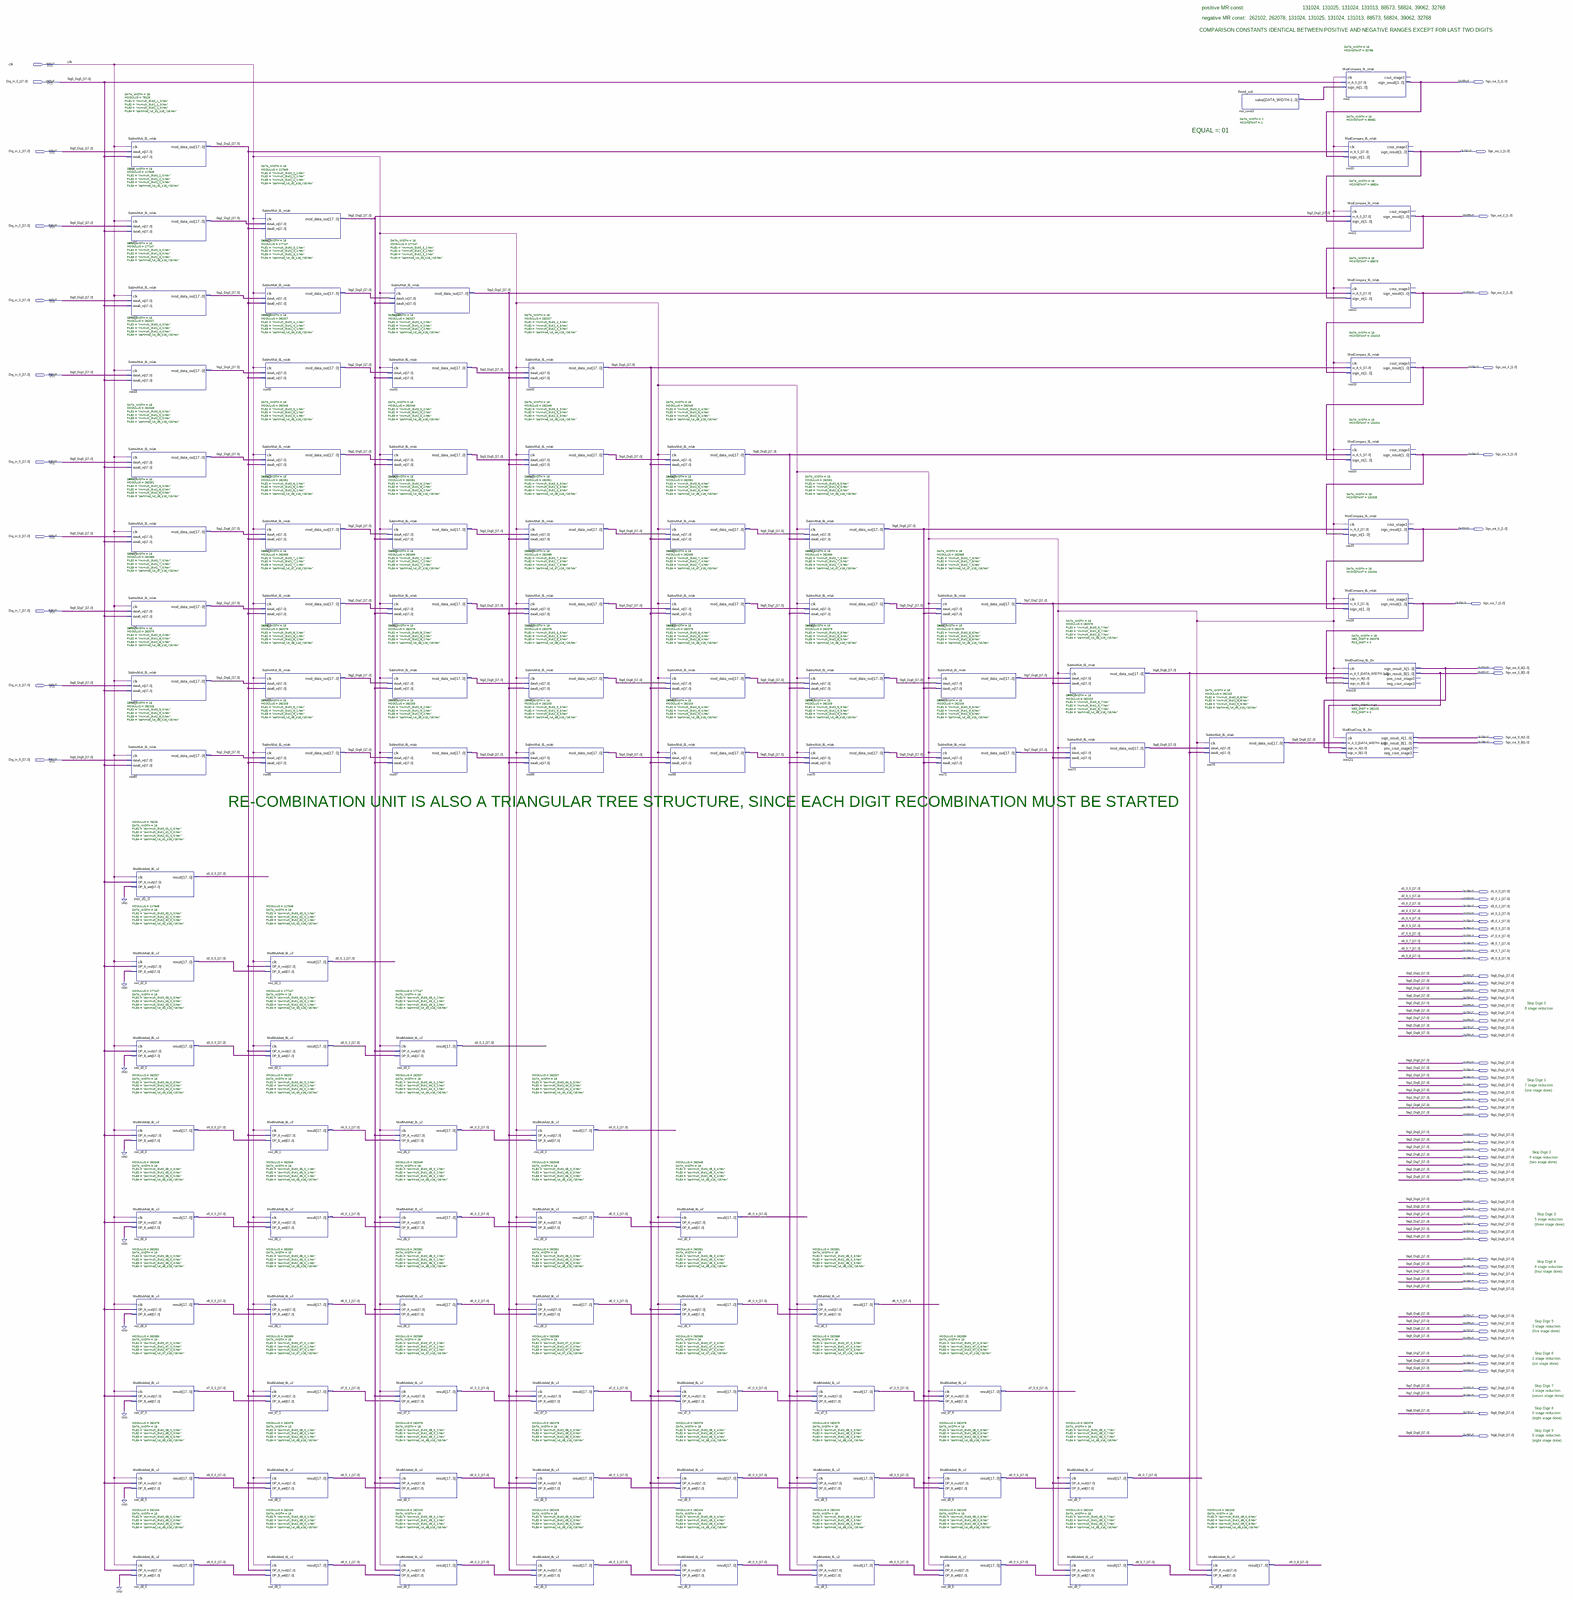
[diagram p0: schematic sheet, whole]
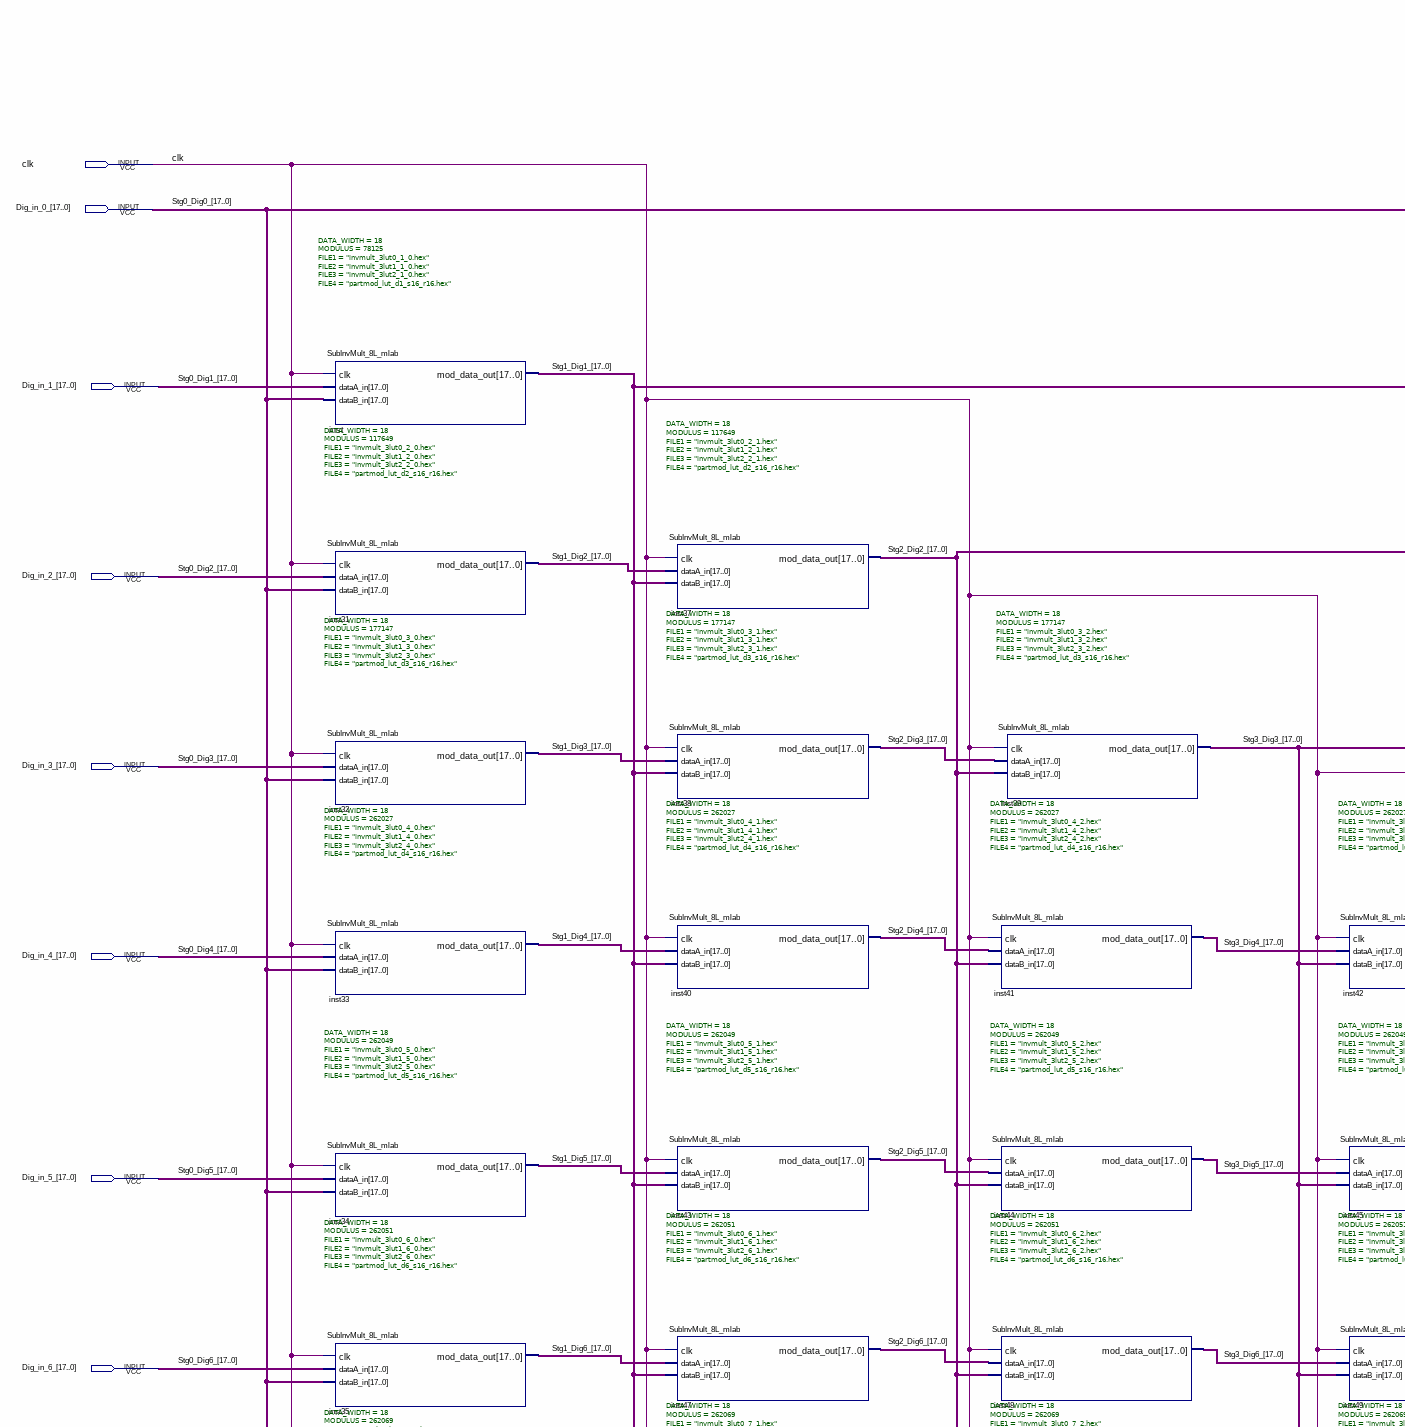
[diagram p1: schematic sheet, upper left part]
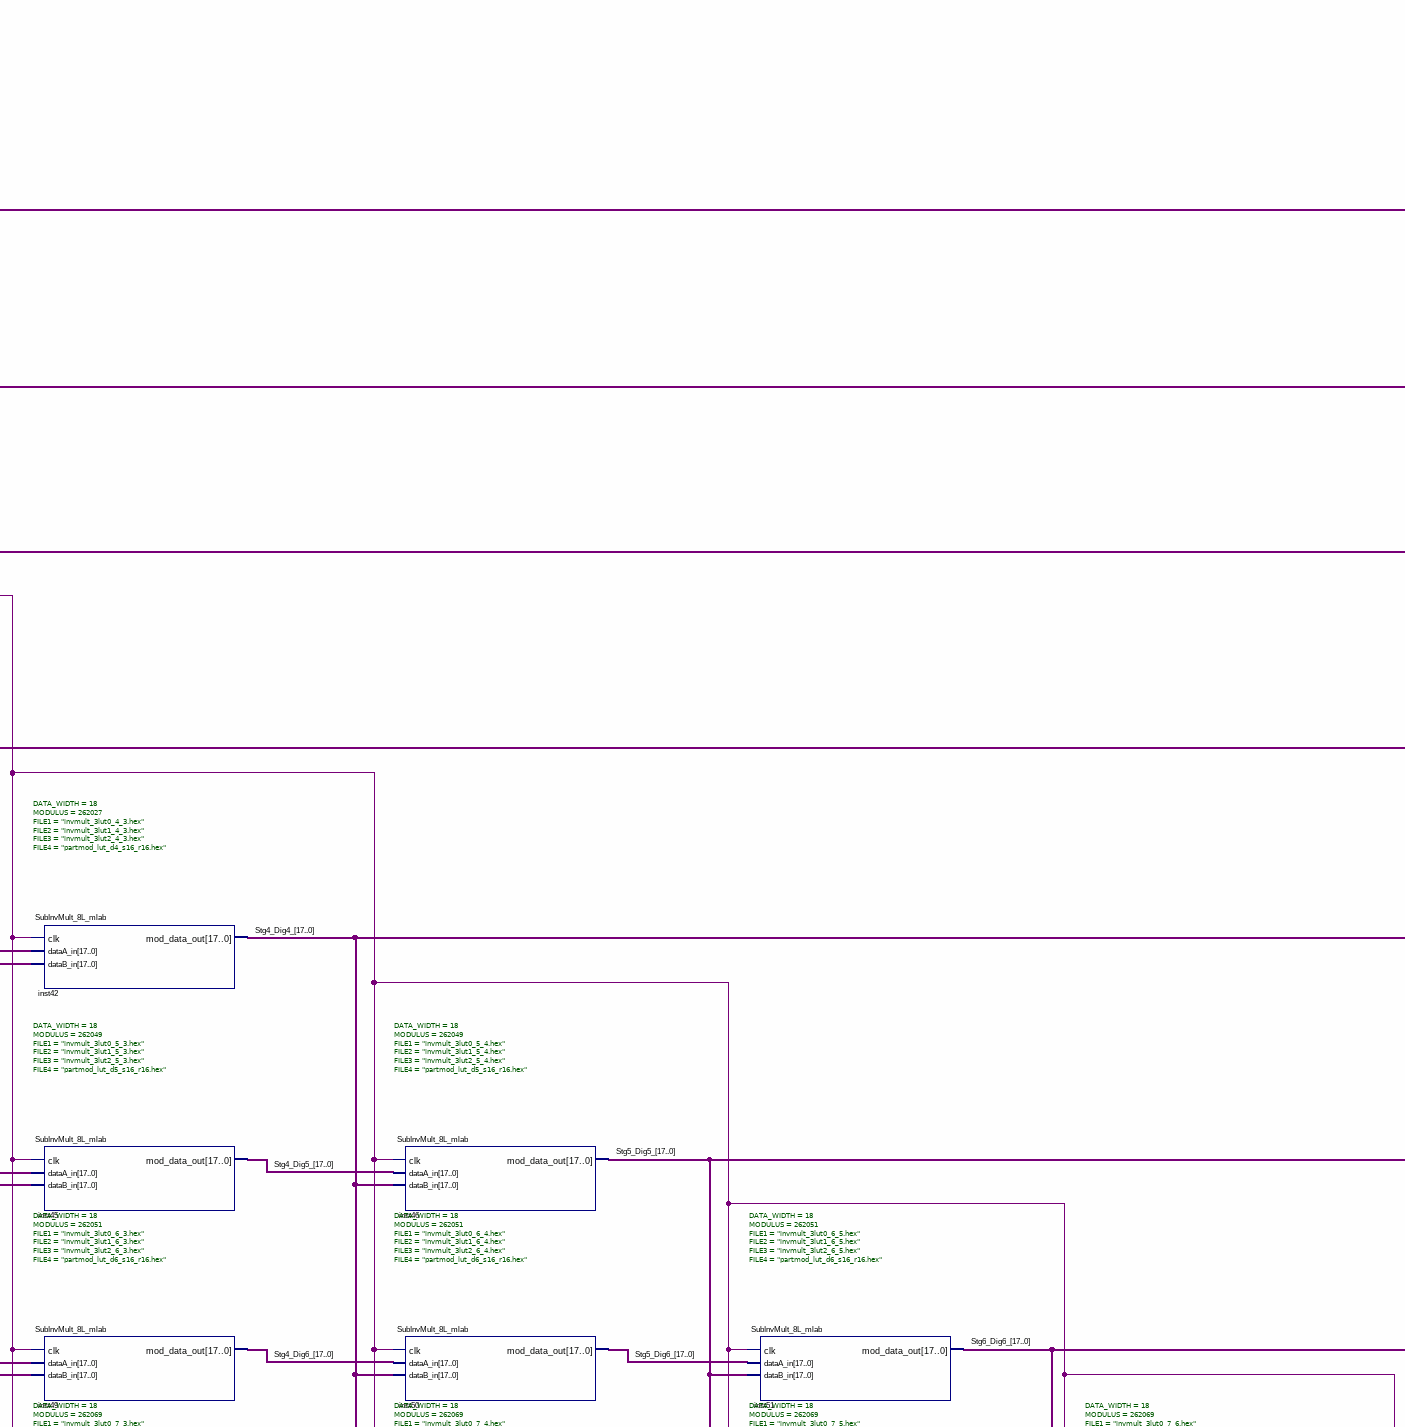
[diagram p2: schematic sheet, upper centre part]
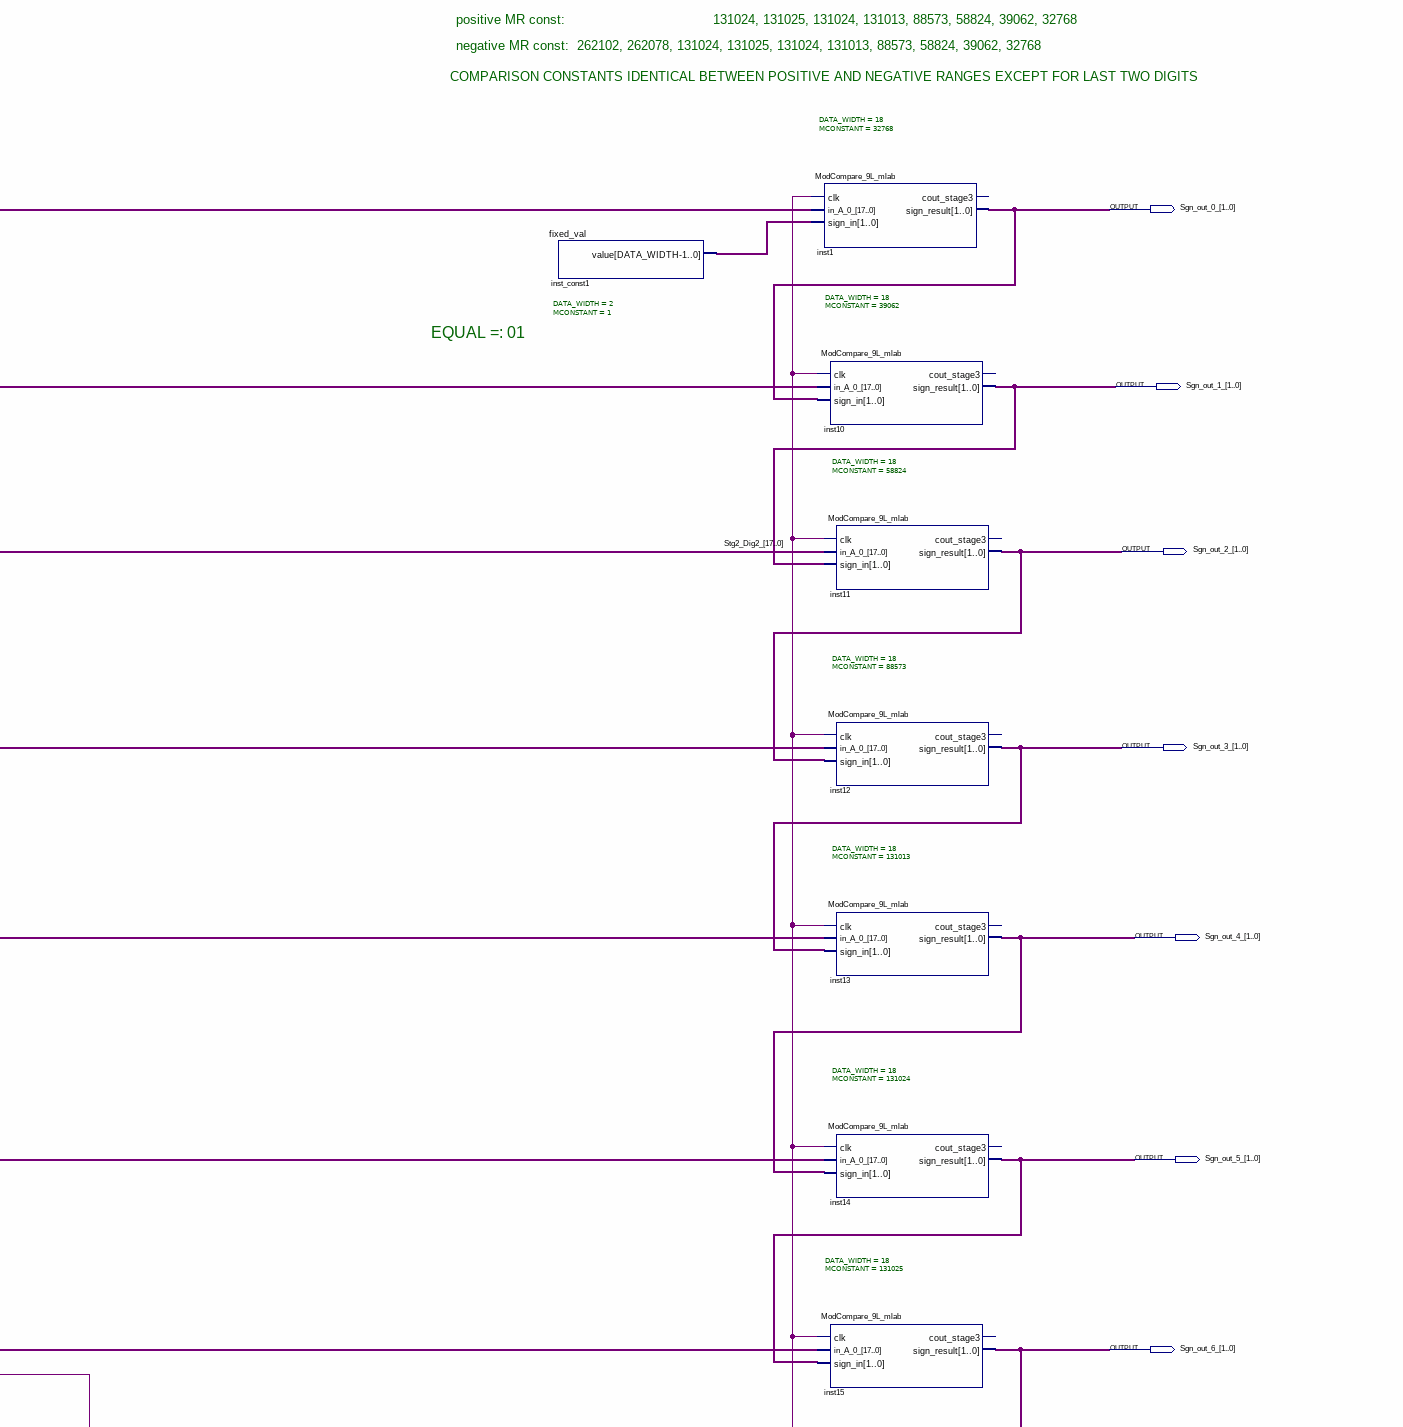
[diagram p3: schematic sheet, upper right part]
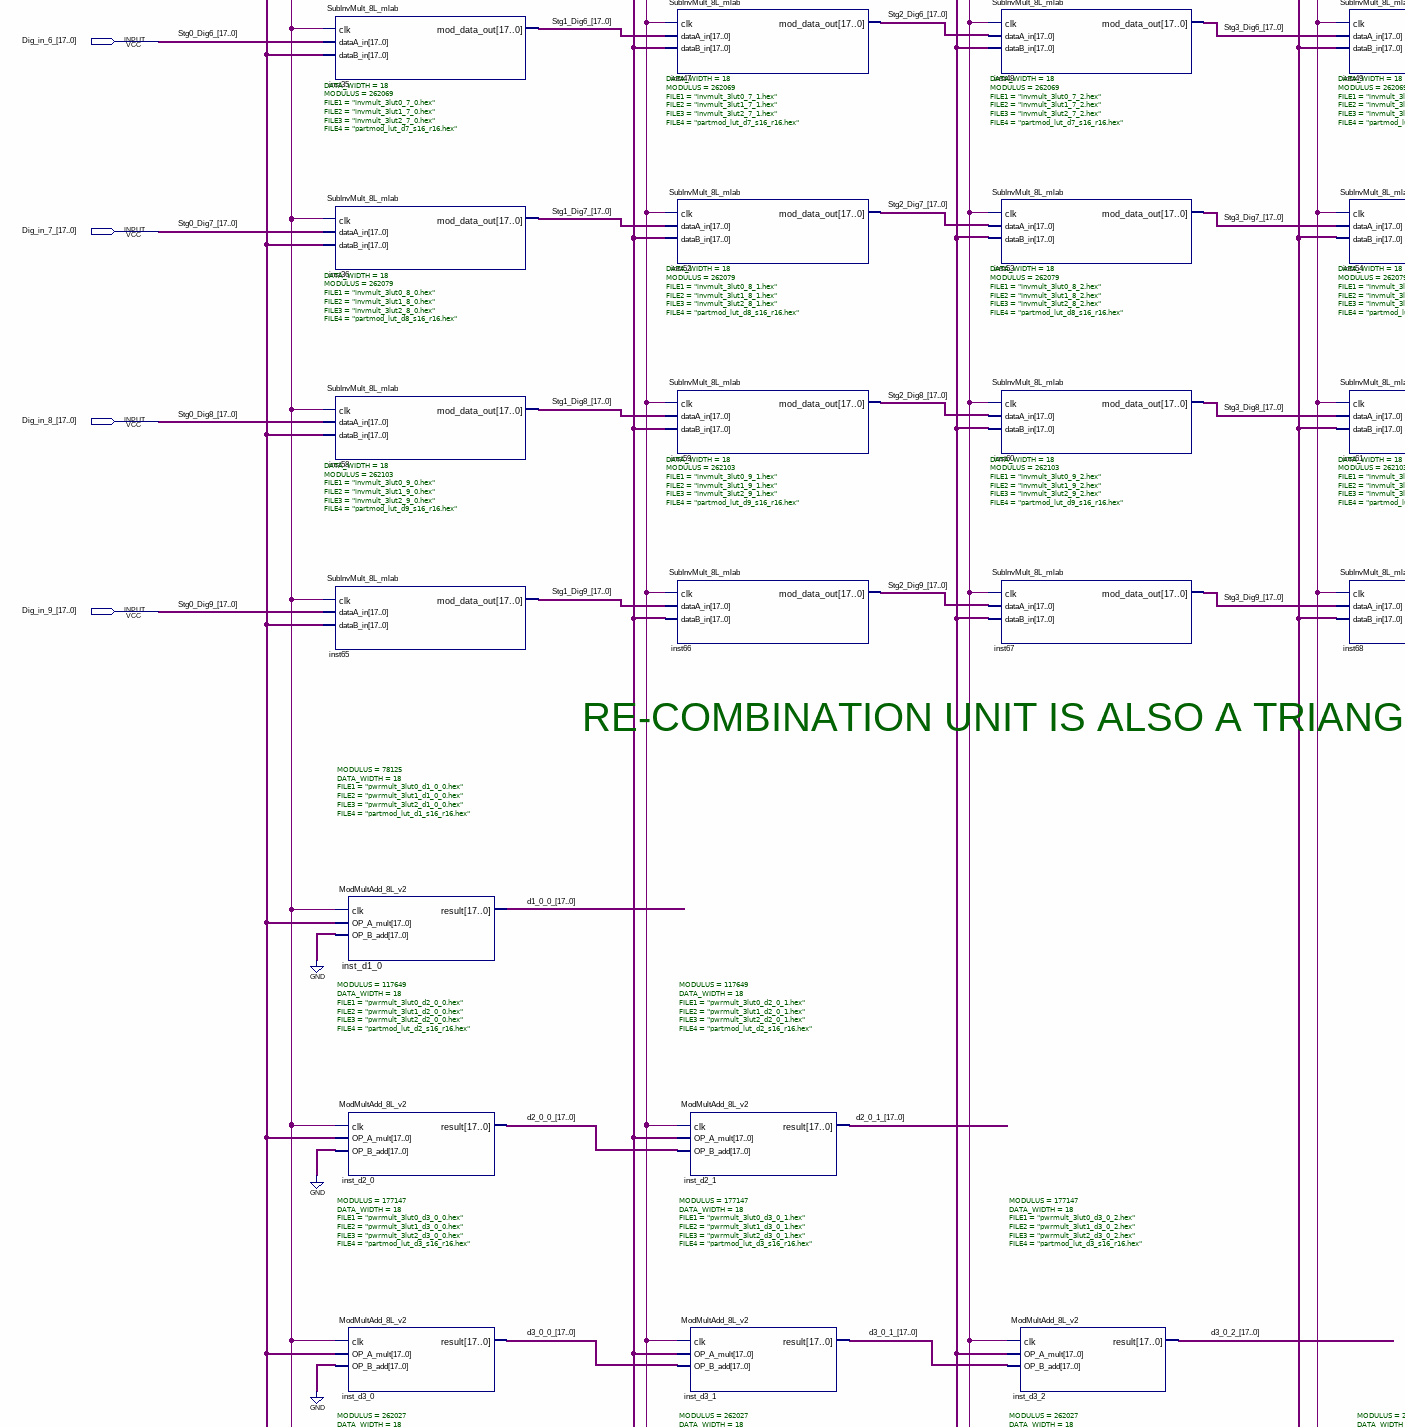
[diagram p4: schematic sheet, middle left part]
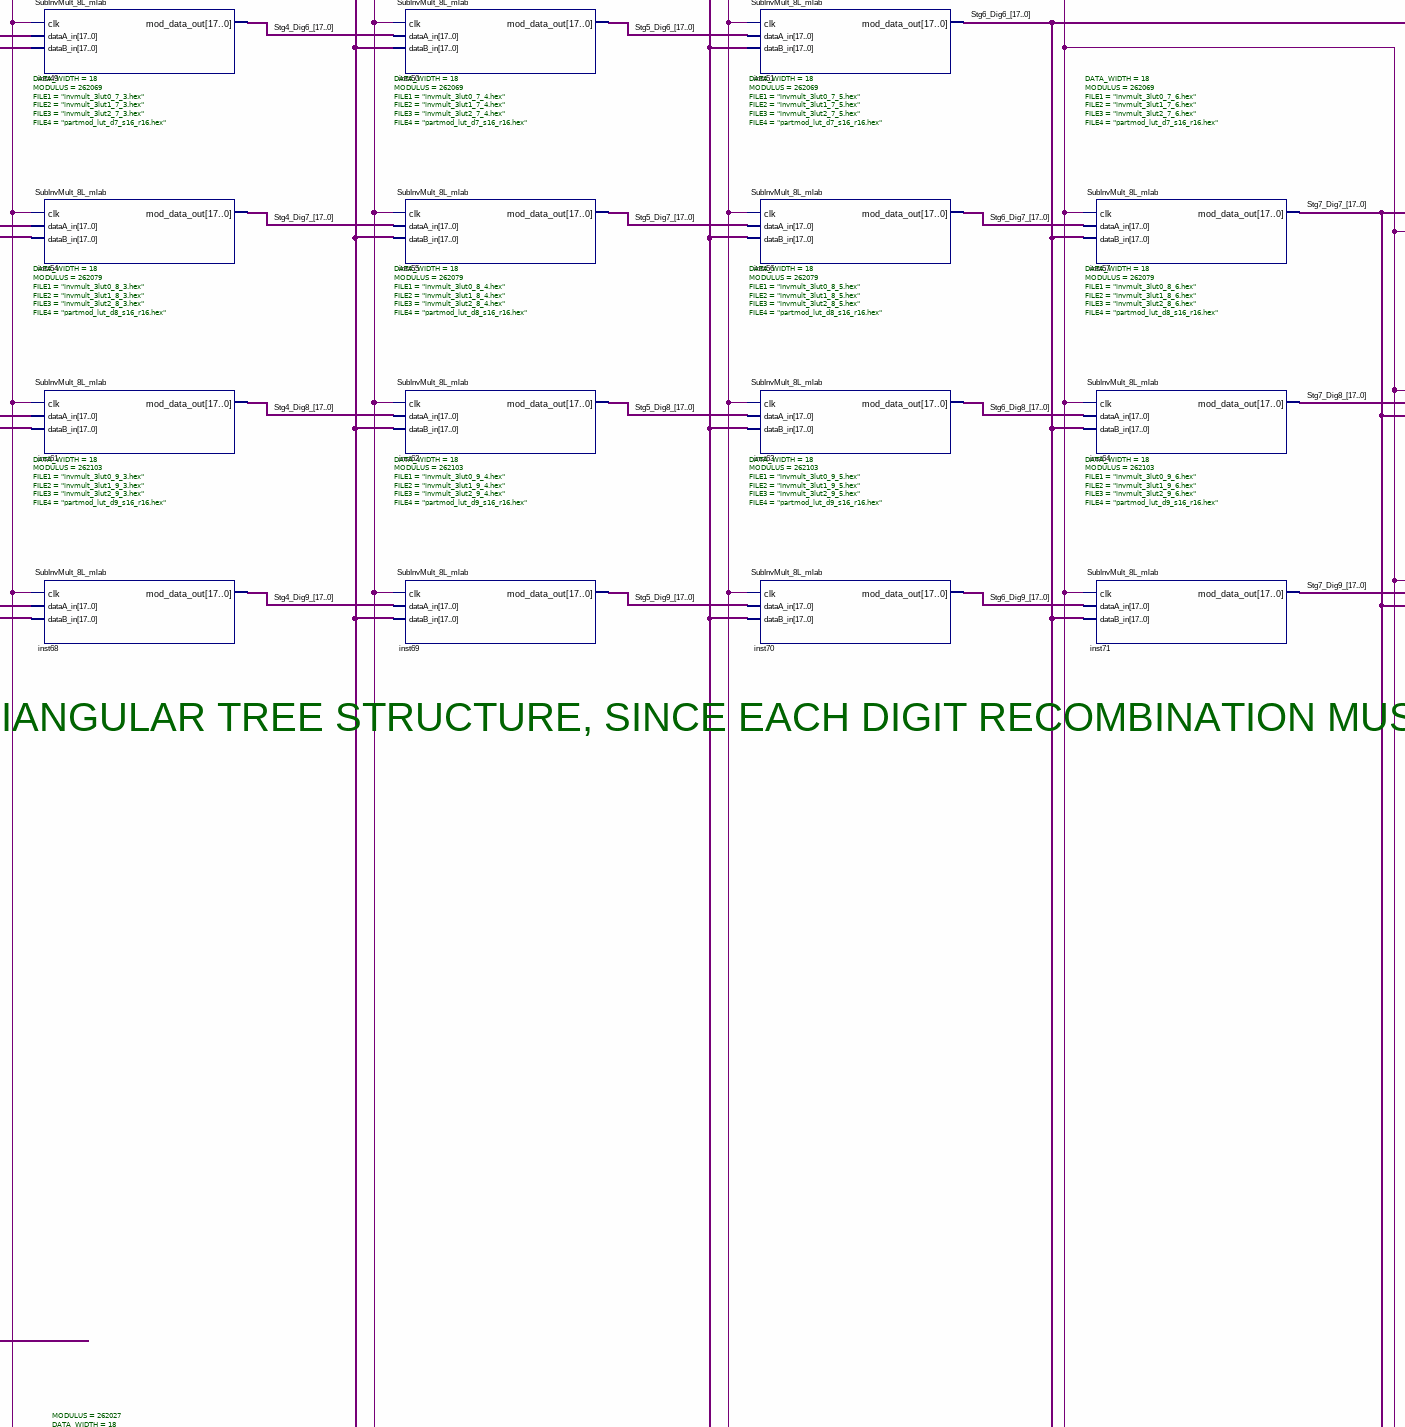
[diagram p5: schematic sheet, middle centre part]
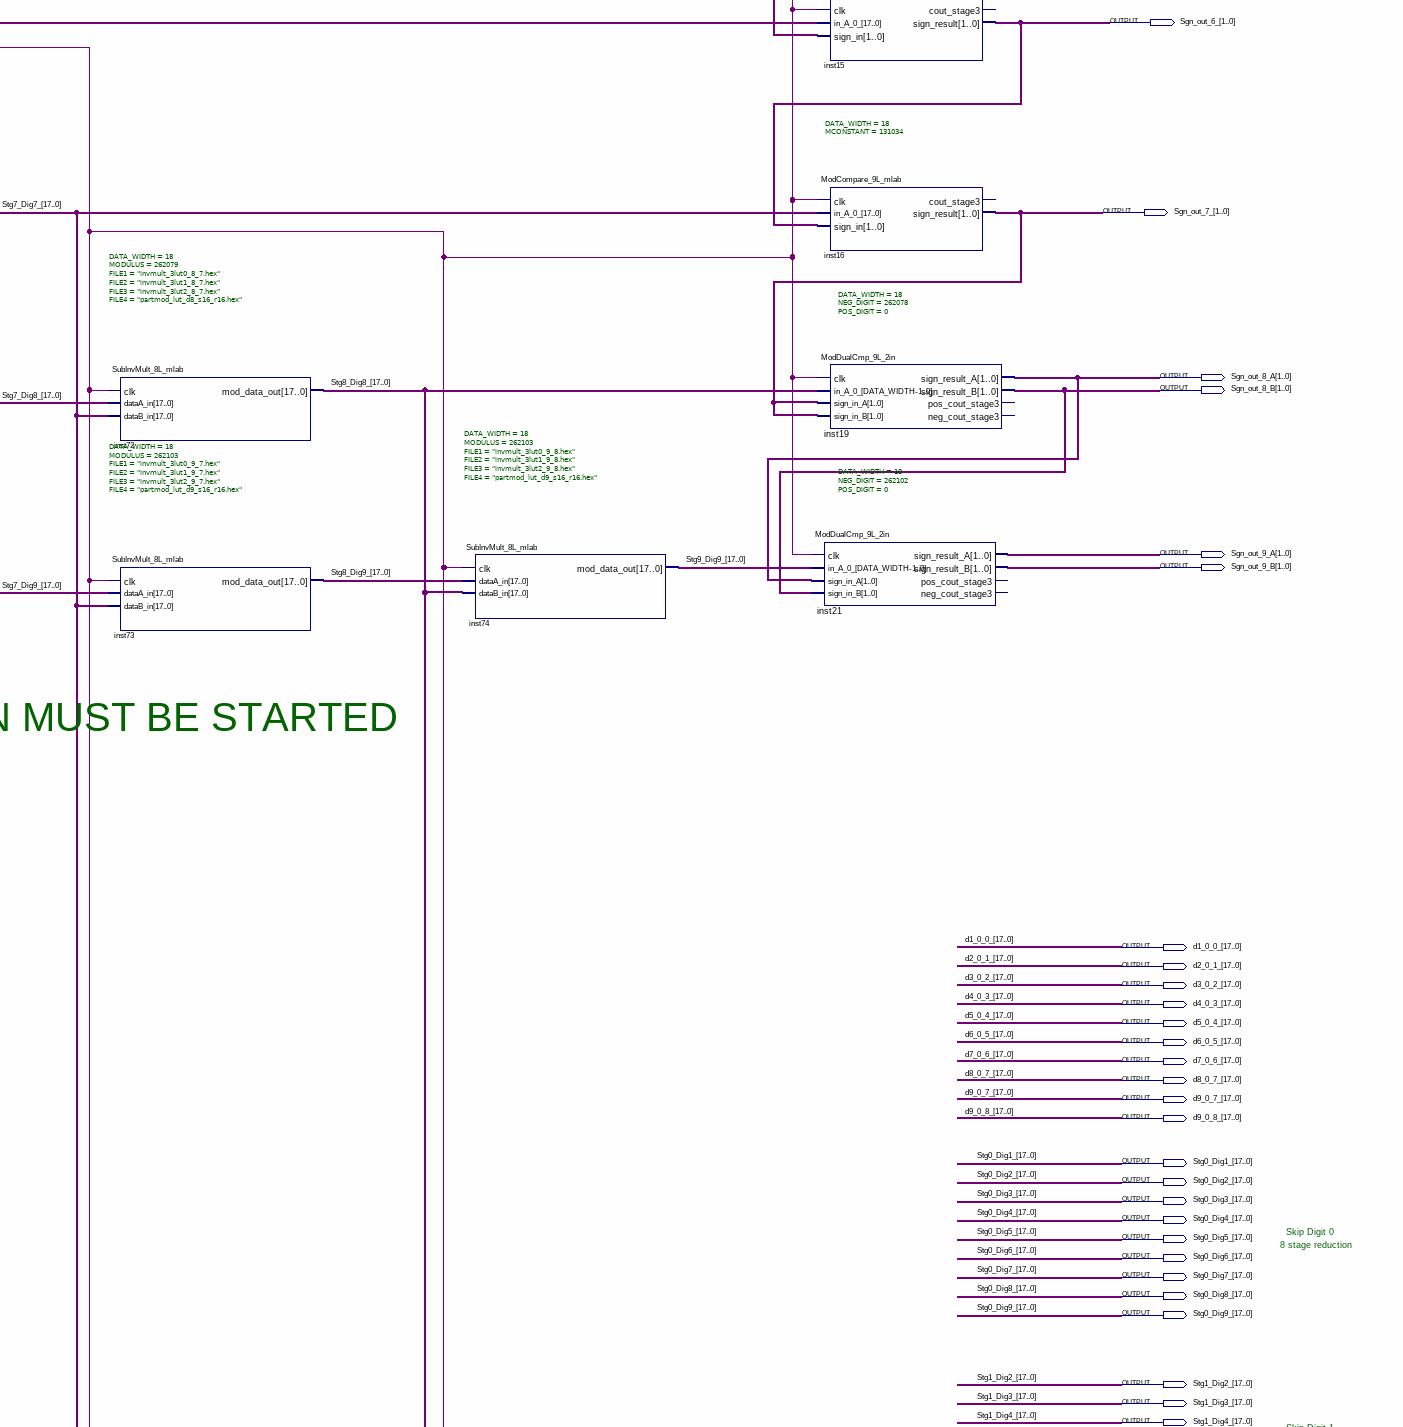
[diagram p6: schematic sheet, middle right part]
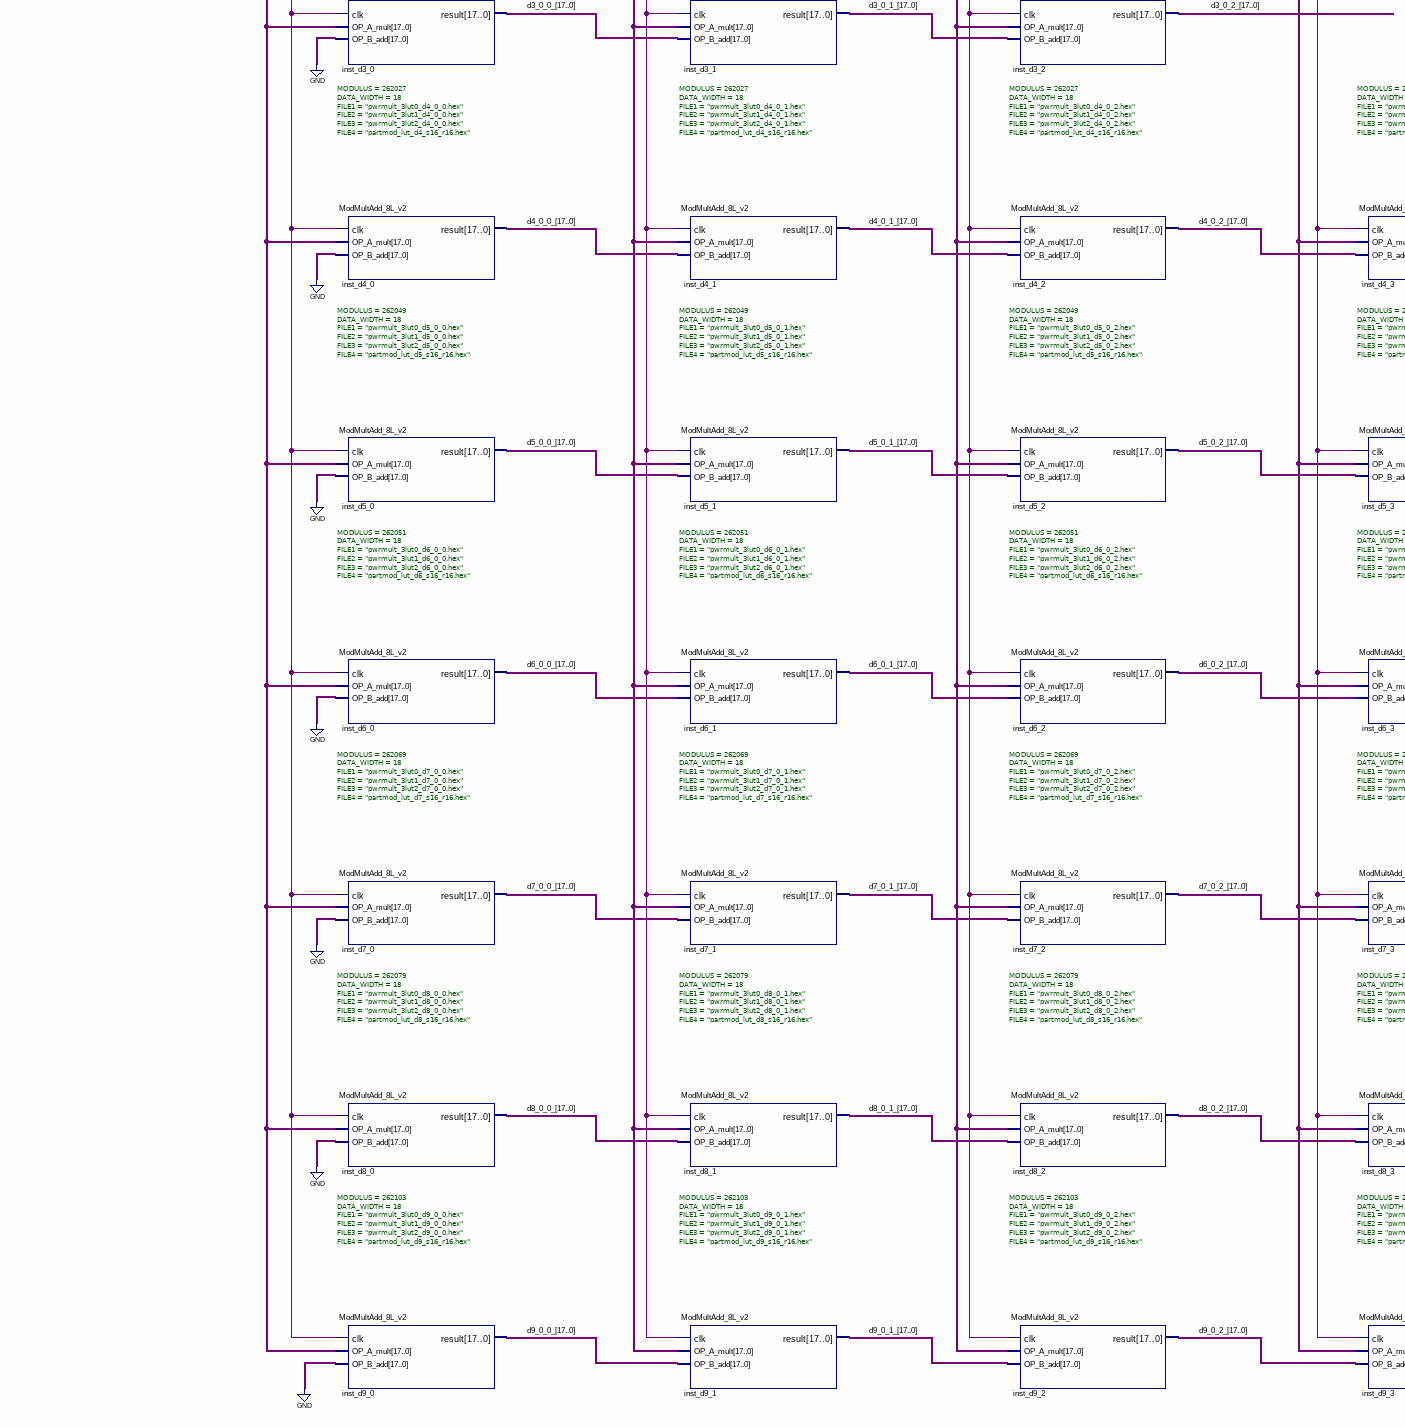
[diagram p7: schematic sheet, lower left part]
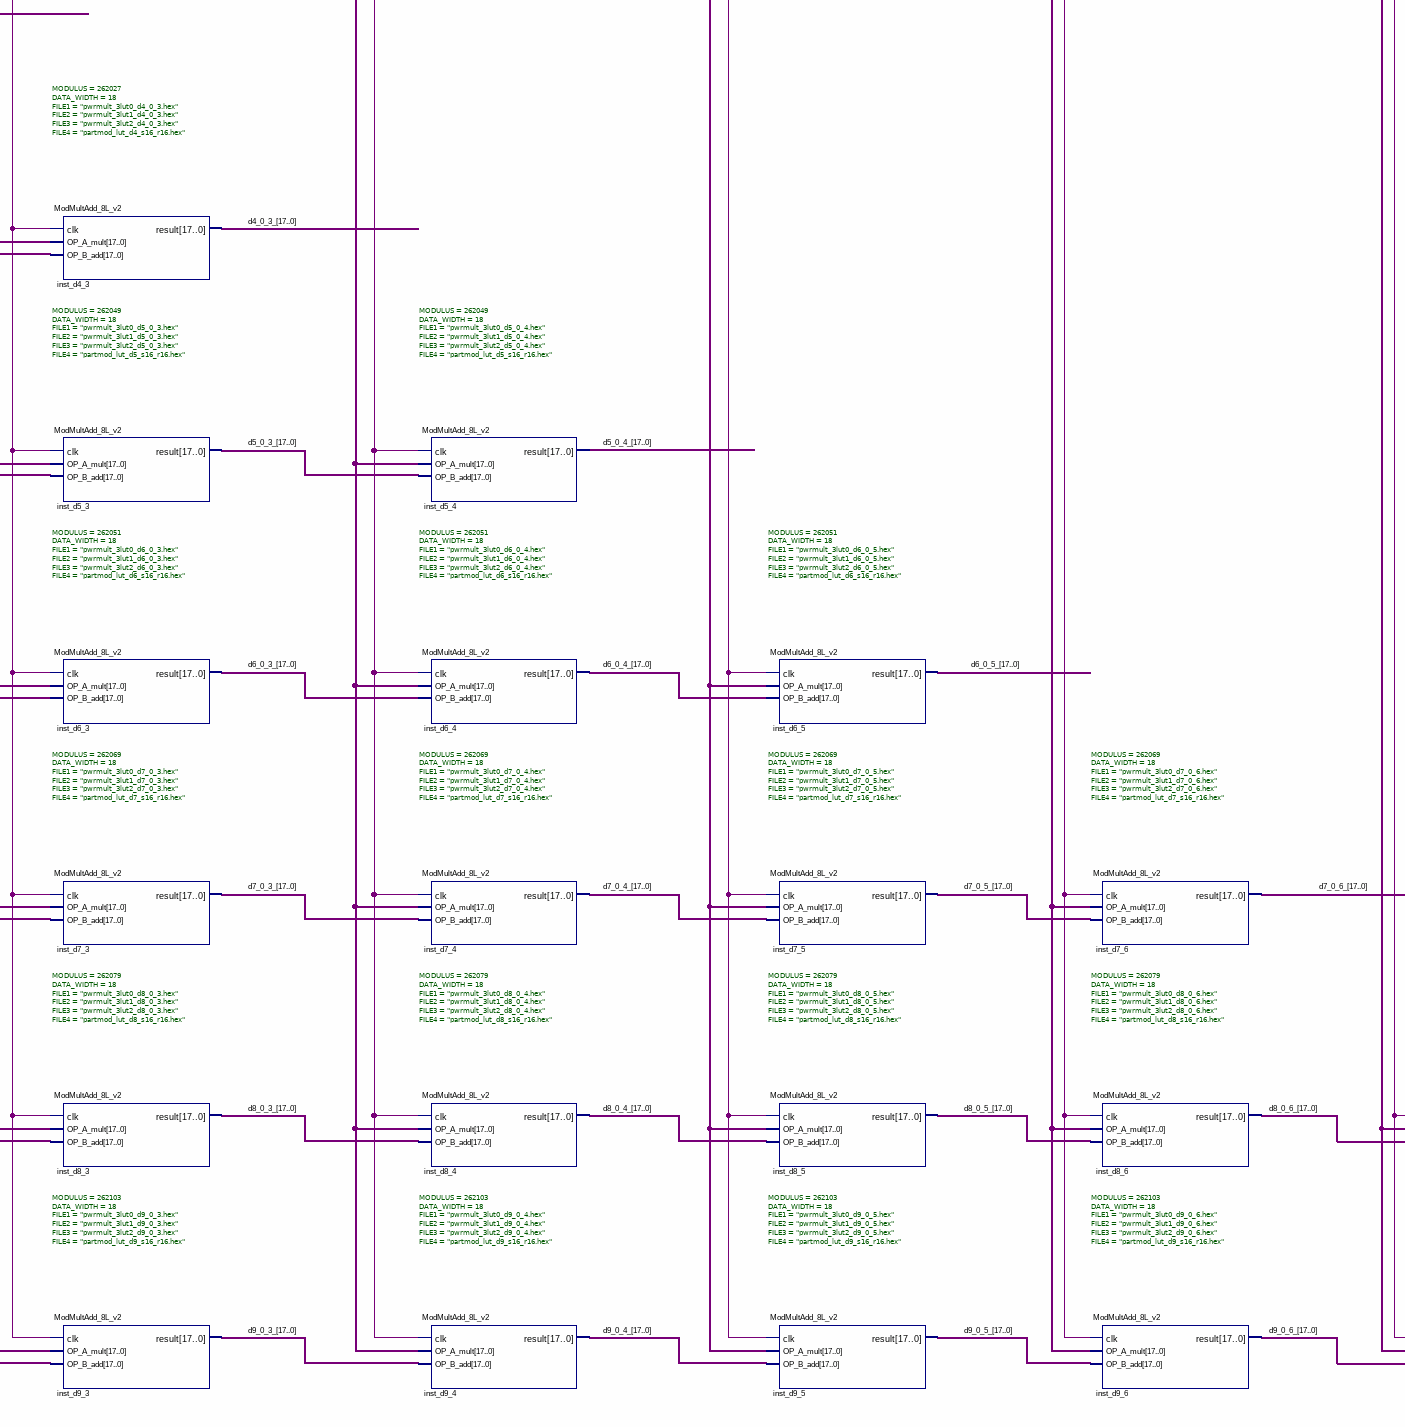
[diagram p8: schematic sheet, lower centre part]
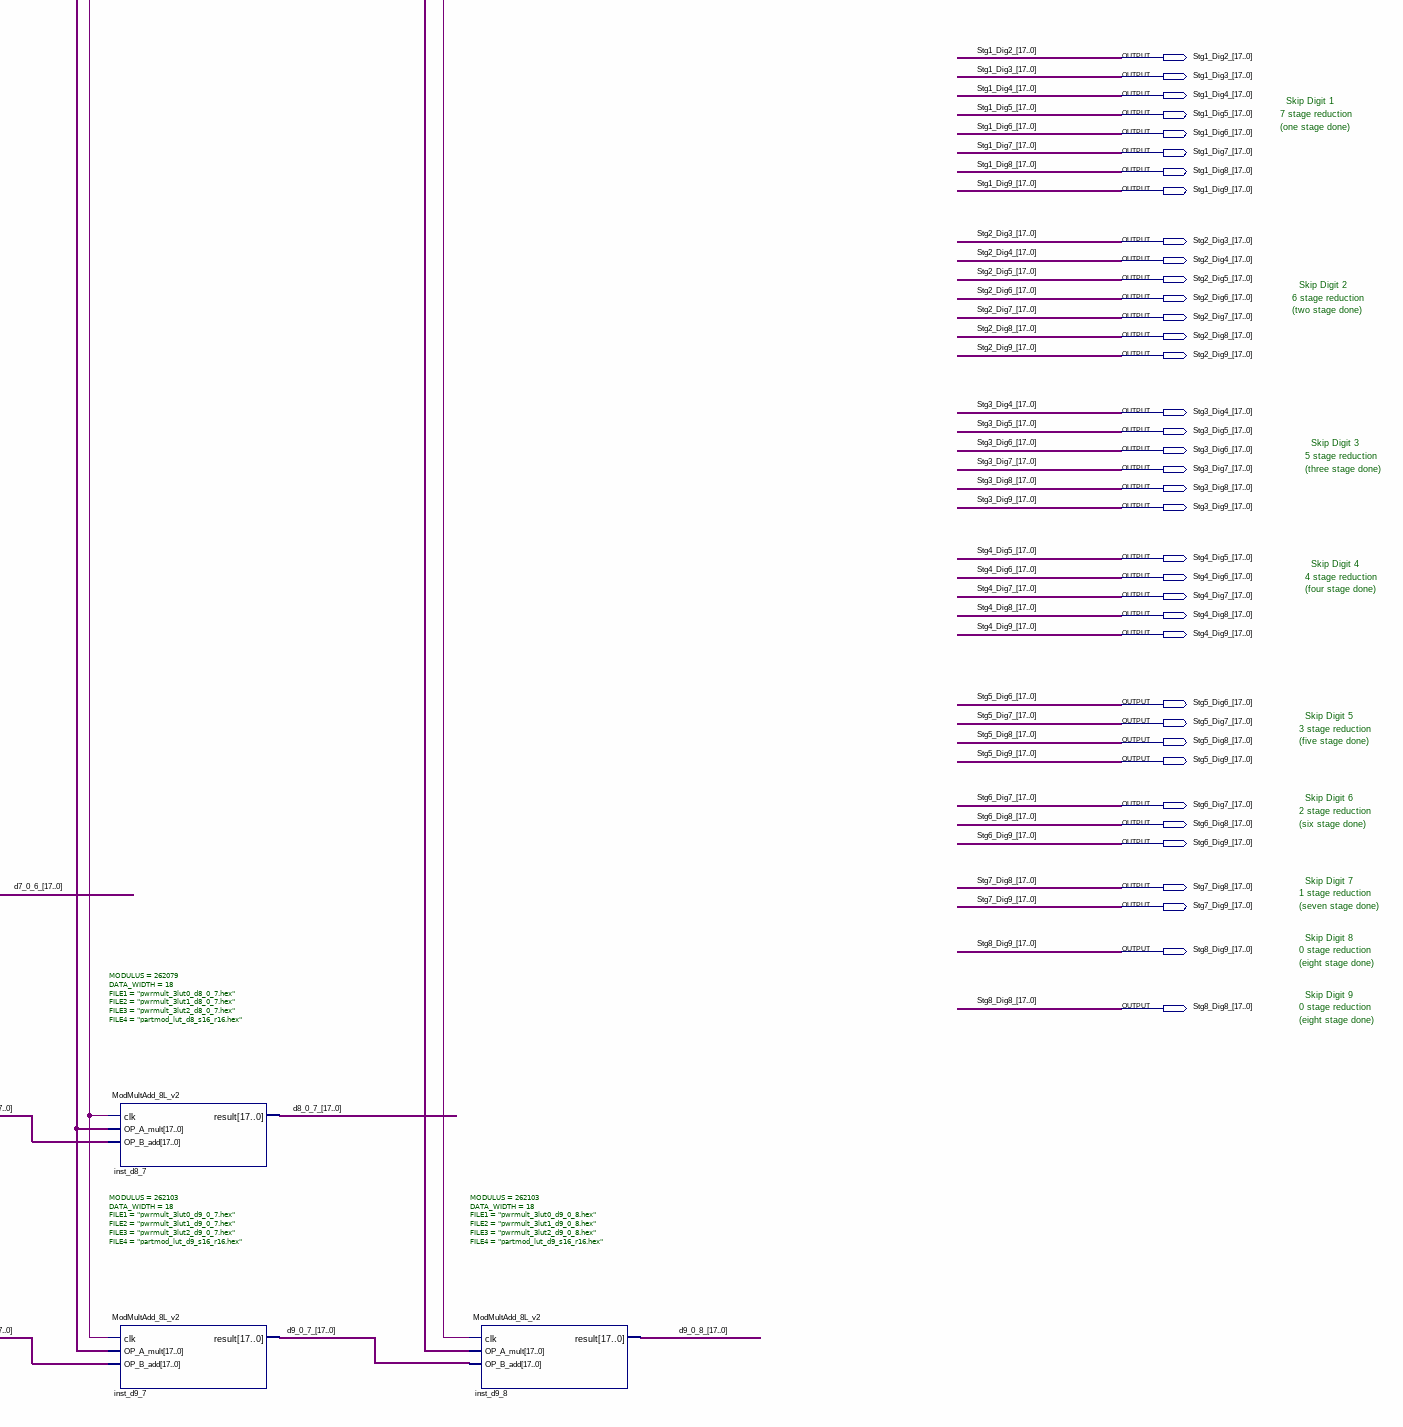
[diagram p9: schematic sheet, lower right part]
// Quartus schematic MRC_pipe_full_ec_v1.bdf as structural Verilog: 101 symbols, 79 pins
module MRC_pipe_full_ec_v1 (
  input  clk,
  input  [17:0] Dig_in_0_,
  input  [17:0] Dig_in_1_,
  input  [17:0] Dig_in_2_,
  input  [17:0] Dig_in_3_,
  input  [17:0] Dig_in_4_,
  input  [17:0] Dig_in_5_,
  input  [17:0] Dig_in_6_,
  input  [17:0] Dig_in_7_,
  input  [17:0] Dig_in_8_,
  input  [17:0] Dig_in_9_,
  output [1:0] Sgn_out_0_,
  output [1:0] Sgn_out_1_,
  output [1:0] Sgn_out_2_,
  output [1:0] Sgn_out_3_,
  output [1:0] Sgn_out_4_,
  output [1:0] Sgn_out_5_,
  output [1:0] Sgn_out_6_,
  output [1:0] Sgn_out_7_,
  output [1:0] Sgn_out_8_A,
  output [1:0] Sgn_out_8_B,
  output [1:0] Sgn_out_9_A,
  output [1:0] Sgn_out_9_B,
  output [17:0] d1_0_0_,
  output [17:0] d2_0_1_,
  output [17:0] d3_0_2_,
  output [17:0] d4_0_3_,
  output [17:0] d5_0_4_,
  output [17:0] d6_0_5_,
  output [17:0] d7_0_6_,
  output [17:0] d8_0_7_,
  output [17:0] d9_0_7_,
  output [17:0] d9_0_8_,
  output [17:0] Stg0_Dig1_,
  output [17:0] Stg0_Dig2_,
  output [17:0] Stg0_Dig3_,
  output [17:0] Stg0_Dig4_,
  output [17:0] Stg0_Dig5_,
  output [17:0] Stg0_Dig6_,
  output [17:0] Stg0_Dig7_,
  output [17:0] Stg0_Dig8_,
  output [17:0] Stg0_Dig9_,
  output [17:0] Stg1_Dig2_,
  output [17:0] Stg1_Dig3_,
  output [17:0] Stg1_Dig4_,
  output [17:0] Stg1_Dig5_,
  output [17:0] Stg1_Dig6_,
  output [17:0] Stg1_Dig7_,
  output [17:0] Stg1_Dig8_,
  output [17:0] Stg1_Dig9_,
  output [17:0] Stg2_Dig3_,
  output [17:0] Stg2_Dig4_,
  output [17:0] Stg2_Dig5_,
  output [17:0] Stg2_Dig6_,
  output [17:0] Stg2_Dig7_,
  output [17:0] Stg2_Dig8_,
  output [17:0] Stg2_Dig9_,
  output [17:0] Stg3_Dig4_,
  output [17:0] Stg3_Dig5_,
  output [17:0] Stg3_Dig6_,
  output [17:0] Stg3_Dig7_,
  output [17:0] Stg3_Dig8_,
  output [17:0] Stg3_Dig9_,
  output [17:0] Stg4_Dig5_,
  output [17:0] Stg4_Dig6_,
  output [17:0] Stg4_Dig7_,
  output [17:0] Stg4_Dig8_,
  output [17:0] Stg4_Dig9_,
  output [17:0] Stg5_Dig6_,
  output [17:0] Stg5_Dig7_,
  output [17:0] Stg5_Dig8_,
  output [17:0] Stg5_Dig9_,
  output [17:0] Stg6_Dig7_,
  output [17:0] Stg6_Dig8_,
  output [17:0] Stg6_Dig9_,
  output [17:0] Stg7_Dig8_,
  output [17:0] Stg7_Dig9_,
  output [17:0] Stg8_Dig9_,
  output [17:0] Stg8_Dig8_
);

  wire [1:0] inst_const1_value;
  wire [17:0] d2_0_0_, d3_0_0_, d3_0_1_, d4_0_0_, d4_0_1_, d4_0_2_, d5_0_0_, d5_0_1_, d5_0_2_, d5_0_3_,
       d6_0_0_, d6_0_1_, d6_0_2_, d6_0_3_, d6_0_4_, d7_0_0_, d7_0_1_, d7_0_2_, d7_0_3_, d7_0_4_, d7_0_5_,
       d8_0_0_, d8_0_1_, d8_0_2_, d8_0_3_, d8_0_4_, d8_0_5_, d8_0_6_, d9_0_0_, d9_0_1_, d9_0_2_, d9_0_3_,
       d9_0_4_, d9_0_5_, d9_0_6_, Stg1_Dig1_, Stg2_Dig2_, Stg3_Dig3_, Stg4_Dig4_, Stg5_Dig5_, Stg6_Dig6_,
       Stg7_Dig7_, Stg9_Dig9_;

  SubInvMult_8L_mlab #(.DATA_WIDTH(18), .MODULUS(78125), .FILE1("invmult_3lut0_1_0.hex"), .FILE2("invmult_3lut1_1_0.hex"), .FILE3("invmult_3lut2_1_0.hex"), .FILE4("partmod_lut_d1_s16_r16.hex")) inst (
    .clk(clk), .dataA_in(Dig_in_1_), .dataB_in(Dig_in_0_), .mod_data_out(Stg1_Dig1_));
  SubInvMult_8L_mlab #(.DATA_WIDTH(18), .MODULUS(117649), .FILE1("invmult_3lut0_2_0.hex"), .FILE2("invmult_3lut1_2_0.hex"), .FILE3("invmult_3lut2_2_0.hex"), .FILE4("partmod_lut_d2_s16_r16.hex")) inst31 (
    .clk(clk), .dataA_in(Dig_in_2_), .dataB_in(Dig_in_0_), .mod_data_out(Stg1_Dig2_));
  SubInvMult_8L_mlab #(.DATA_WIDTH(18), .MODULUS(177147), .FILE1("invmult_3lut0_3_0.hex"), .FILE2("invmult_3lut1_3_0.hex"), .FILE3("invmult_3lut2_3_0.hex"), .FILE4("partmod_lut_d3_s16_r16.hex")) inst32 (
    .clk(clk), .dataA_in(Dig_in_3_), .dataB_in(Dig_in_0_), .mod_data_out(Stg1_Dig3_));
  SubInvMult_8L_mlab #(.DATA_WIDTH(18), .MODULUS(262027), .FILE1("invmult_3lut0_4_0.hex"), .FILE2("invmult_3lut1_4_0.hex"), .FILE3("invmult_3lut2_4_0.hex"), .FILE4("partmod_lut_d4_s16_r16.hex")) inst33 (
    .clk(clk), .dataA_in(Dig_in_4_), .dataB_in(Dig_in_0_), .mod_data_out(Stg1_Dig4_));
  SubInvMult_8L_mlab #(.DATA_WIDTH(18), .MODULUS(262049), .FILE1("invmult_3lut0_5_0.hex"), .FILE2("invmult_3lut1_5_0.hex"), .FILE3("invmult_3lut2_5_0.hex"), .FILE4("partmod_lut_d5_s16_r16.hex")) inst34 (
    .clk(clk), .dataA_in(Dig_in_5_), .dataB_in(Dig_in_0_), .mod_data_out(Stg1_Dig5_));
  SubInvMult_8L_mlab #(.DATA_WIDTH(18), .MODULUS(262051), .FILE1("invmult_3lut0_6_0.hex"), .FILE2("invmult_3lut1_6_0.hex"), .FILE3("invmult_3lut2_6_0.hex"), .FILE4("partmod_lut_d6_s16_r16.hex")) inst35 (
    .clk(clk), .dataA_in(Dig_in_6_), .dataB_in(Dig_in_0_), .mod_data_out(Stg1_Dig6_));
  SubInvMult_8L_mlab #(.DATA_WIDTH(18), .MODULUS(262069), .FILE1("invmult_3lut0_7_0.hex"), .FILE2("invmult_3lut1_7_0.hex"), .FILE3("invmult_3lut2_7_0.hex"), .FILE4("partmod_lut_d7_s16_r16.hex")) inst36 (
    .clk(clk), .dataA_in(Dig_in_7_), .dataB_in(Dig_in_0_), .mod_data_out(Stg1_Dig7_));
  SubInvMult_8L_mlab #(.DATA_WIDTH(18), .MODULUS(262079), .FILE1("invmult_3lut0_8_0.hex"), .FILE2("invmult_3lut1_8_0.hex"), .FILE3("invmult_3lut2_8_0.hex"), .FILE4("partmod_lut_d8_s16_r16.hex")) inst58 (
    .clk(clk), .dataA_in(Dig_in_8_), .dataB_in(Dig_in_0_), .mod_data_out(Stg1_Dig8_));
  SubInvMult_8L_mlab #(.DATA_WIDTH(18), .MODULUS(262103), .FILE1("invmult_3lut0_9_0.hex"), .FILE2("invmult_3lut1_9_0.hex"), .FILE3("invmult_3lut2_9_0.hex"), .FILE4("partmod_lut_d9_s16_r16.hex")) inst65 (
    .clk(clk), .dataA_in(Dig_in_9_), .dataB_in(Dig_in_0_), .mod_data_out(Stg1_Dig9_));
  ModMultAdd_8L_v2 #(.MODULUS(78125), .DATA_WIDTH(18), .FILE1("pwrmult_3lut0_d1_0_0.hex"), .FILE2("pwrmult_3lut1_d1_0_0.hex"), .FILE3("pwrmult_3lut2_d1_0_0.hex"), .FILE4("partmod_lut_d1_s16_r16.hex")) inst_d1_0 (
    .clk(clk), .OP_A_mult(Dig_in_0_), .OP_B_add({18{1'b0}}), .result(d1_0_0_));
  ModMultAdd_8L_v2 #(.MODULUS(117649), .DATA_WIDTH(18), .FILE1("pwrmult_3lut0_d2_0_0.hex"), .FILE2("pwrmult_3lut1_d2_0_0.hex"), .FILE3("pwrmult_3lut2_d2_0_0.hex"), .FILE4("partmod_lut_d2_s16_r16.hex")) inst_d2_0 (
    .clk(clk), .OP_A_mult(Dig_in_0_), .OP_B_add({18{1'b0}}), .result(d2_0_0_));
  ModMultAdd_8L_v2 #(.MODULUS(177147), .DATA_WIDTH(18), .FILE1("pwrmult_3lut0_d3_0_0.hex"), .FILE2("pwrmult_3lut1_d3_0_0.hex"), .FILE3("pwrmult_3lut2_d3_0_0.hex"), .FILE4("partmod_lut_d3_s16_r16.hex")) inst_d3_0 (
    .clk(clk), .OP_A_mult(Dig_in_0_), .OP_B_add({18{1'b0}}), .result(d3_0_0_));
  ModMultAdd_8L_v2 #(.MODULUS(262027), .DATA_WIDTH(18), .FILE1("pwrmult_3lut0_d4_0_0.hex"), .FILE2("pwrmult_3lut1_d4_0_0.hex"), .FILE3("pwrmult_3lut2_d4_0_0.hex"), .FILE4("partmod_lut_d4_s16_r16.hex")) inst_d4_0 (
    .clk(clk), .OP_A_mult(Dig_in_0_), .OP_B_add({18{1'b0}}), .result(d4_0_0_));
  ModMultAdd_8L_v2 #(.MODULUS(262049), .DATA_WIDTH(18), .FILE1("pwrmult_3lut0_d5_0_0.hex"), .FILE2("pwrmult_3lut1_d5_0_0.hex"), .FILE3("pwrmult_3lut2_d5_0_0.hex"), .FILE4("partmod_lut_d5_s16_r16.hex")) inst_d5_0 (
    .clk(clk), .OP_A_mult(Dig_in_0_), .OP_B_add({18{1'b0}}), .result(d5_0_0_));
  ModMultAdd_8L_v2 #(.MODULUS(262051), .DATA_WIDTH(18), .FILE1("pwrmult_3lut0_d6_0_0.hex"), .FILE2("pwrmult_3lut1_d6_0_0.hex"), .FILE3("pwrmult_3lut2_d6_0_0.hex"), .FILE4("partmod_lut_d6_s16_r16.hex")) inst_d6_0 (
    .clk(clk), .OP_A_mult(Dig_in_0_), .OP_B_add({18{1'b0}}), .result(d6_0_0_));
  ModMultAdd_8L_v2 #(.MODULUS(262069), .DATA_WIDTH(18), .FILE1("pwrmult_3lut0_d7_0_0.hex"), .FILE2("pwrmult_3lut1_d7_0_0.hex"), .FILE3("pwrmult_3lut2_d7_0_0.hex"), .FILE4("partmod_lut_d7_s16_r16.hex")) inst_d7_0 (
    .clk(clk), .OP_A_mult(Dig_in_0_), .OP_B_add({18{1'b0}}), .result(d7_0_0_));
  ModMultAdd_8L_v2 #(.MODULUS(262079), .DATA_WIDTH(18), .FILE1("pwrmult_3lut0_d8_0_0.hex"), .FILE2("pwrmult_3lut1_d8_0_0.hex"), .FILE3("pwrmult_3lut2_d8_0_0.hex"), .FILE4("partmod_lut_d8_s16_r16.hex")) inst_d8_0 (
    .clk(clk), .OP_A_mult(Dig_in_0_), .OP_B_add({18{1'b0}}), .result(d8_0_0_));
  ModMultAdd_8L_v2 #(.MODULUS(262103), .DATA_WIDTH(18), .FILE1("pwrmult_3lut0_d9_0_0.hex"), .FILE2("pwrmult_3lut1_d9_0_0.hex"), .FILE3("pwrmult_3lut2_d9_0_0.hex"), .FILE4("partmod_lut_d9_s16_r16.hex")) inst_d9_0 (
    .clk(clk), .OP_A_mult(Dig_in_0_), .OP_B_add({18{1'b0}}), .result(d9_0_0_));
  SubInvMult_8L_mlab #(.DATA_WIDTH(18), .MODULUS(117649), .FILE1("invmult_3lut0_2_1.hex"), .FILE2("invmult_3lut1_2_1.hex"), .FILE3("invmult_3lut2_2_1.hex"), .FILE4("partmod_lut_d2_s16_r16.hex")) inst37 (
    .clk(clk), .dataA_in(Stg1_Dig2_), .dataB_in(Stg1_Dig1_), .mod_data_out(Stg2_Dig2_));
  SubInvMult_8L_mlab #(.DATA_WIDTH(18), .MODULUS(177147), .FILE1("invmult_3lut0_3_1.hex"), .FILE2("invmult_3lut1_3_1.hex"), .FILE3("invmult_3lut2_3_1.hex"), .FILE4("partmod_lut_d3_s16_r16.hex")) inst38 (
    .clk(clk), .dataA_in(Stg1_Dig3_), .dataB_in(Stg1_Dig1_), .mod_data_out(Stg2_Dig3_));
  SubInvMult_8L_mlab #(.DATA_WIDTH(18), .MODULUS(262027), .FILE1("invmult_3lut0_4_1.hex"), .FILE2("invmult_3lut1_4_1.hex"), .FILE3("invmult_3lut2_4_1.hex"), .FILE4("partmod_lut_d4_s16_r16.hex")) inst40 (
    .clk(clk), .dataA_in(Stg1_Dig4_), .dataB_in(Stg1_Dig1_), .mod_data_out(Stg2_Dig4_));
  SubInvMult_8L_mlab #(.DATA_WIDTH(18), .MODULUS(262049), .FILE1("invmult_3lut0_5_1.hex"), .FILE2("invmult_3lut1_5_1.hex"), .FILE3("invmult_3lut2_5_1.hex"), .FILE4("partmod_lut_d5_s16_r16.hex")) inst43 (
    .clk(clk), .dataA_in(Stg1_Dig5_), .dataB_in(Stg1_Dig1_), .mod_data_out(Stg2_Dig5_));
  SubInvMult_8L_mlab #(.DATA_WIDTH(18), .MODULUS(262051), .FILE1("invmult_3lut0_6_1.hex"), .FILE2("invmult_3lut1_6_1.hex"), .FILE3("invmult_3lut2_6_1.hex"), .FILE4("partmod_lut_d6_s16_r16.hex")) inst47 (
    .clk(clk), .dataA_in(Stg1_Dig6_), .dataB_in(Stg1_Dig1_), .mod_data_out(Stg2_Dig6_));
  SubInvMult_8L_mlab #(.DATA_WIDTH(18), .MODULUS(262069), .FILE1("invmult_3lut0_7_1.hex"), .FILE2("invmult_3lut1_7_1.hex"), .FILE3("invmult_3lut2_7_1.hex"), .FILE4("partmod_lut_d7_s16_r16.hex")) inst52 (
    .clk(clk), .dataA_in(Stg1_Dig7_), .dataB_in(Stg1_Dig1_), .mod_data_out(Stg2_Dig7_));
  SubInvMult_8L_mlab #(.DATA_WIDTH(18), .MODULUS(262079), .FILE1("invmult_3lut0_8_1.hex"), .FILE2("invmult_3lut1_8_1.hex"), .FILE3("invmult_3lut2_8_1.hex"), .FILE4("partmod_lut_d8_s16_r16.hex")) inst59 (
    .clk(clk), .dataA_in(Stg1_Dig8_), .dataB_in(Stg1_Dig1_), .mod_data_out(Stg2_Dig8_));
  SubInvMult_8L_mlab #(.DATA_WIDTH(18), .MODULUS(262103), .FILE1("invmult_3lut0_9_1.hex"), .FILE2("invmult_3lut1_9_1.hex"), .FILE3("invmult_3lut2_9_1.hex"), .FILE4("partmod_lut_d9_s16_r16.hex")) inst66 (
    .clk(clk), .dataA_in(Stg1_Dig9_), .dataB_in(Stg1_Dig1_), .mod_data_out(Stg2_Dig9_));
  ModMultAdd_8L_v2 #(.MODULUS(117649), .DATA_WIDTH(18), .FILE1("pwrmult_3lut0_d2_0_1.hex"), .FILE2("pwrmult_3lut1_d2_0_1.hex"), .FILE3("pwrmult_3lut2_d2_0_1.hex"), .FILE4("partmod_lut_d2_s16_r16.hex")) inst_d2_1 (
    .clk(clk), .OP_A_mult(Stg1_Dig1_), .OP_B_add(d2_0_0_), .result(d2_0_1_));
  ModMultAdd_8L_v2 #(.MODULUS(177147), .DATA_WIDTH(18), .FILE1("pwrmult_3lut0_d3_0_1.hex"), .FILE2("pwrmult_3lut1_d3_0_1.hex"), .FILE3("pwrmult_3lut2_d3_0_1.hex"), .FILE4("partmod_lut_d3_s16_r16.hex")) inst_d3_1 (
    .clk(clk), .OP_A_mult(Stg1_Dig1_), .OP_B_add(d3_0_0_), .result(d3_0_1_));
  ModMultAdd_8L_v2 #(.MODULUS(262027), .DATA_WIDTH(18), .FILE1("pwrmult_3lut0_d4_0_1.hex"), .FILE2("pwrmult_3lut1_d4_0_1.hex"), .FILE3("pwrmult_3lut2_d4_0_1.hex"), .FILE4("partmod_lut_d4_s16_r16.hex")) inst_d4_1 (
    .clk(clk), .OP_A_mult(Stg1_Dig1_), .OP_B_add(d4_0_0_), .result(d4_0_1_));
  ModMultAdd_8L_v2 #(.MODULUS(262049), .DATA_WIDTH(18), .FILE1("pwrmult_3lut0_d5_0_1.hex"), .FILE2("pwrmult_3lut1_d5_0_1.hex"), .FILE3("pwrmult_3lut2_d5_0_1.hex"), .FILE4("partmod_lut_d5_s16_r16.hex")) inst_d5_1 (
    .clk(clk), .OP_A_mult(Stg1_Dig1_), .OP_B_add(d5_0_0_), .result(d5_0_1_));
  ModMultAdd_8L_v2 #(.MODULUS(262051), .DATA_WIDTH(18), .FILE1("pwrmult_3lut0_d6_0_1.hex"), .FILE2("pwrmult_3lut1_d6_0_1.hex"), .FILE3("pwrmult_3lut2_d6_0_1.hex"), .FILE4("partmod_lut_d6_s16_r16.hex")) inst_d6_1 (
    .clk(clk), .OP_A_mult(Stg1_Dig1_), .OP_B_add(d6_0_0_), .result(d6_0_1_));
  ModMultAdd_8L_v2 #(.MODULUS(262069), .DATA_WIDTH(18), .FILE1("pwrmult_3lut0_d7_0_1.hex"), .FILE2("pwrmult_3lut1_d7_0_1.hex"), .FILE3("pwrmult_3lut2_d7_0_1.hex"), .FILE4("partmod_lut_d7_s16_r16.hex")) inst_d7_1 (
    .clk(clk), .OP_A_mult(Stg1_Dig1_), .OP_B_add(d7_0_0_), .result(d7_0_1_));
  ModMultAdd_8L_v2 #(.MODULUS(262079), .DATA_WIDTH(18), .FILE1("pwrmult_3lut0_d8_0_1.hex"), .FILE2("pwrmult_3lut1_d8_0_1.hex"), .FILE3("pwrmult_3lut2_d8_0_1.hex"), .FILE4("partmod_lut_d8_s16_r16.hex")) inst_d8_1 (
    .clk(clk), .OP_A_mult(Stg1_Dig1_), .OP_B_add(d8_0_0_), .result(d8_0_1_));
  ModMultAdd_8L_v2 #(.MODULUS(262103), .DATA_WIDTH(18), .FILE1("pwrmult_3lut0_d9_0_1.hex"), .FILE2("pwrmult_3lut1_d9_0_1.hex"), .FILE3("pwrmult_3lut2_d9_0_1.hex"), .FILE4("partmod_lut_d9_s16_r16.hex")) inst_d9_1 (
    .clk(clk), .OP_A_mult(Stg1_Dig1_), .OP_B_add(d9_0_0_), .result(d9_0_1_));
  SubInvMult_8L_mlab #(.DATA_WIDTH(18), .MODULUS(177147), .FILE1("invmult_3lut0_3_2.hex"), .FILE2("invmult_3lut1_3_2.hex"), .FILE3("invmult_3lut2_3_2.hex"), .FILE4("partmod_lut_d3_s16_r16.hex")) inst39 (
    .clk(clk), .dataA_in(Stg2_Dig3_), .dataB_in(Stg2_Dig2_), .mod_data_out(Stg3_Dig3_));
  SubInvMult_8L_mlab #(.DATA_WIDTH(18), .MODULUS(262027), .FILE1("invmult_3lut0_4_2.hex"), .FILE2("invmult_3lut1_4_2.hex"), .FILE3("invmult_3lut2_4_2.hex"), .FILE4("partmod_lut_d4_s16_r16.hex")) inst41 (
    .clk(clk), .dataA_in(Stg2_Dig4_), .dataB_in(Stg2_Dig2_), .mod_data_out(Stg3_Dig4_));
  SubInvMult_8L_mlab #(.DATA_WIDTH(18), .MODULUS(262049), .FILE1("invmult_3lut0_5_2.hex"), .FILE2("invmult_3lut1_5_2.hex"), .FILE3("invmult_3lut2_5_2.hex"), .FILE4("partmod_lut_d5_s16_r16.hex")) inst44 (
    .clk(clk), .dataA_in(Stg2_Dig5_), .dataB_in(Stg2_Dig2_), .mod_data_out(Stg3_Dig5_));
  SubInvMult_8L_mlab #(.DATA_WIDTH(18), .MODULUS(262051), .FILE1("invmult_3lut0_6_2.hex"), .FILE2("invmult_3lut1_6_2.hex"), .FILE3("invmult_3lut2_6_2.hex"), .FILE4("partmod_lut_d6_s16_r16.hex")) inst48 (
    .clk(clk), .dataA_in(Stg2_Dig6_), .dataB_in(Stg2_Dig2_), .mod_data_out(Stg3_Dig6_));
  SubInvMult_8L_mlab #(.DATA_WIDTH(18), .MODULUS(262069), .FILE1("invmult_3lut0_7_2.hex"), .FILE2("invmult_3lut1_7_2.hex"), .FILE3("invmult_3lut2_7_2.hex"), .FILE4("partmod_lut_d7_s16_r16.hex")) inst53 (
    .clk(clk), .dataA_in(Stg2_Dig7_), .dataB_in(Stg2_Dig2_), .mod_data_out(Stg3_Dig7_));
  SubInvMult_8L_mlab #(.DATA_WIDTH(18), .MODULUS(262079), .FILE1("invmult_3lut0_8_2.hex"), .FILE2("invmult_3lut1_8_2.hex"), .FILE3("invmult_3lut2_8_2.hex"), .FILE4("partmod_lut_d8_s16_r16.hex")) inst60 (
    .clk(clk), .dataA_in(Stg2_Dig8_), .dataB_in(Stg2_Dig2_), .mod_data_out(Stg3_Dig8_));
  SubInvMult_8L_mlab #(.DATA_WIDTH(18), .MODULUS(262103), .FILE1("invmult_3lut0_9_2.hex"), .FILE2("invmult_3lut1_9_2.hex"), .FILE3("invmult_3lut2_9_2.hex"), .FILE4("partmod_lut_d9_s16_r16.hex")) inst67 (
    .clk(clk), .dataA_in(Stg2_Dig9_), .dataB_in(Stg2_Dig2_), .mod_data_out(Stg3_Dig9_));
  ModMultAdd_8L_v2 #(.MODULUS(177147), .DATA_WIDTH(18), .FILE1("pwrmult_3lut0_d3_0_2.hex"), .FILE2("pwrmult_3lut1_d3_0_2.hex"), .FILE3("pwrmult_3lut2_d3_0_2.hex"), .FILE4("partmod_lut_d3_s16_r16.hex")) inst_d3_2 (
    .clk(clk), .OP_A_mult(Stg2_Dig2_), .OP_B_add(d3_0_1_), .result(d3_0_2_));
  ModMultAdd_8L_v2 #(.MODULUS(262027), .DATA_WIDTH(18), .FILE1("pwrmult_3lut0_d4_0_2.hex"), .FILE2("pwrmult_3lut1_d4_0_2.hex"), .FILE3("pwrmult_3lut2_d4_0_2.hex"), .FILE4("partmod_lut_d4_s16_r16.hex")) inst_d4_2 (
    .clk(clk), .OP_A_mult(Stg2_Dig2_), .OP_B_add(d4_0_1_), .result(d4_0_2_));
  ModMultAdd_8L_v2 #(.MODULUS(262049), .DATA_WIDTH(18), .FILE1("pwrmult_3lut0_d5_0_2.hex"), .FILE2("pwrmult_3lut1_d5_0_2.hex"), .FILE3("pwrmult_3lut2_d5_0_2.hex"), .FILE4("partmod_lut_d5_s16_r16.hex")) inst_d5_2 (
    .clk(clk), .OP_A_mult(Stg2_Dig2_), .OP_B_add(d5_0_1_), .result(d5_0_2_));
  ModMultAdd_8L_v2 #(.MODULUS(262051), .DATA_WIDTH(18), .FILE1("pwrmult_3lut0_d6_0_2.hex"), .FILE2("pwrmult_3lut1_d6_0_2.hex"), .FILE3("pwrmult_3lut2_d6_0_2.hex"), .FILE4("partmod_lut_d6_s16_r16.hex")) inst_d6_2 (
    .clk(clk), .OP_A_mult(Stg2_Dig2_), .OP_B_add(d6_0_1_), .result(d6_0_2_));
  ModMultAdd_8L_v2 #(.MODULUS(262069), .DATA_WIDTH(18), .FILE1("pwrmult_3lut0_d7_0_2.hex"), .FILE2("pwrmult_3lut1_d7_0_2.hex"), .FILE3("pwrmult_3lut2_d7_0_2.hex"), .FILE4("partmod_lut_d7_s16_r16.hex")) inst_d7_2 (
    .clk(clk), .OP_A_mult(Stg2_Dig2_), .OP_B_add(d7_0_1_), .result(d7_0_2_));
  ModMultAdd_8L_v2 #(.MODULUS(262079), .DATA_WIDTH(18), .FILE1("pwrmult_3lut0_d8_0_2.hex"), .FILE2("pwrmult_3lut1_d8_0_2.hex"), .FILE3("pwrmult_3lut2_d8_0_2.hex"), .FILE4("partmod_lut_d8_s16_r16.hex")) inst_d8_2 (
    .clk(clk), .OP_A_mult(Stg2_Dig2_), .OP_B_add(d8_0_1_), .result(d8_0_2_));
  ModMultAdd_8L_v2 #(.MODULUS(262103), .DATA_WIDTH(18), .FILE1("pwrmult_3lut0_d9_0_2.hex"), .FILE2("pwrmult_3lut1_d9_0_2.hex"), .FILE3("pwrmult_3lut2_d9_0_2.hex"), .FILE4("partmod_lut_d9_s16_r16.hex")) inst_d9_2 (
    .clk(clk), .OP_A_mult(Stg2_Dig2_), .OP_B_add(d9_0_1_), .result(d9_0_2_));
  SubInvMult_8L_mlab #(.DATA_WIDTH(18), .MODULUS(262027), .FILE1("invmult_3lut0_4_3.hex"), .FILE2("invmult_3lut1_4_3.hex"), .FILE3("invmult_3lut2_4_3.hex"), .FILE4("partmod_lut_d4_s16_r16.hex")) inst42 (
    .clk(clk), .dataA_in(Stg3_Dig4_), .dataB_in(Stg3_Dig3_), .mod_data_out(Stg4_Dig4_));
  SubInvMult_8L_mlab #(.DATA_WIDTH(18), .MODULUS(262049), .FILE1("invmult_3lut0_5_3.hex"), .FILE2("invmult_3lut1_5_3.hex"), .FILE3("invmult_3lut2_5_3.hex"), .FILE4("partmod_lut_d5_s16_r16.hex")) inst45 (
    .clk(clk), .dataA_in(Stg3_Dig5_), .dataB_in(Stg3_Dig3_), .mod_data_out(Stg4_Dig5_));
  SubInvMult_8L_mlab #(.DATA_WIDTH(18), .MODULUS(262051), .FILE1("invmult_3lut0_6_3.hex"), .FILE2("invmult_3lut1_6_3.hex"), .FILE3("invmult_3lut2_6_3.hex"), .FILE4("partmod_lut_d6_s16_r16.hex")) inst49 (
    .clk(clk), .dataA_in(Stg3_Dig6_), .dataB_in(Stg3_Dig3_), .mod_data_out(Stg4_Dig6_));
  SubInvMult_8L_mlab #(.DATA_WIDTH(18), .MODULUS(262069), .FILE1("invmult_3lut0_7_3.hex"), .FILE2("invmult_3lut1_7_3.hex"), .FILE3("invmult_3lut2_7_3.hex"), .FILE4("partmod_lut_d7_s16_r16.hex")) inst54 (
    .clk(clk), .dataA_in(Stg3_Dig7_), .dataB_in(Stg3_Dig3_), .mod_data_out(Stg4_Dig7_));
  SubInvMult_8L_mlab #(.DATA_WIDTH(18), .MODULUS(262079), .FILE1("invmult_3lut0_8_3.hex"), .FILE2("invmult_3lut1_8_3.hex"), .FILE3("invmult_3lut2_8_3.hex"), .FILE4("partmod_lut_d8_s16_r16.hex")) inst61 (
    .clk(clk), .dataA_in(Stg3_Dig8_), .dataB_in(Stg3_Dig3_), .mod_data_out(Stg4_Dig8_));
  SubInvMult_8L_mlab #(.DATA_WIDTH(18), .MODULUS(262103), .FILE1("invmult_3lut0_9_3.hex"), .FILE2("invmult_3lut1_9_3.hex"), .FILE3("invmult_3lut2_9_3.hex"), .FILE4("partmod_lut_d9_s16_r16.hex")) inst68 (
    .clk(clk), .dataA_in(Stg3_Dig9_), .dataB_in(Stg3_Dig3_), .mod_data_out(Stg4_Dig9_));
  ModMultAdd_8L_v2 #(.MODULUS(262027), .DATA_WIDTH(18), .FILE1("pwrmult_3lut0_d4_0_3.hex"), .FILE2("pwrmult_3lut1_d4_0_3.hex"), .FILE3("pwrmult_3lut2_d4_0_3.hex"), .FILE4("partmod_lut_d4_s16_r16.hex")) inst_d4_3 (
    .clk(clk), .OP_A_mult(Stg3_Dig3_), .OP_B_add(d4_0_2_), .result(d4_0_3_));
  ModMultAdd_8L_v2 #(.MODULUS(262049), .DATA_WIDTH(18), .FILE1("pwrmult_3lut0_d5_0_3.hex"), .FILE2("pwrmult_3lut1_d5_0_3.hex"), .FILE3("pwrmult_3lut2_d5_0_3.hex"), .FILE4("partmod_lut_d5_s16_r16.hex")) inst_d5_3 (
    .clk(clk), .OP_A_mult(Stg3_Dig3_), .OP_B_add(d5_0_2_), .result(d5_0_3_));
  ModMultAdd_8L_v2 #(.MODULUS(262051), .DATA_WIDTH(18), .FILE1("pwrmult_3lut0_d6_0_3.hex"), .FILE2("pwrmult_3lut1_d6_0_3.hex"), .FILE3("pwrmult_3lut2_d6_0_3.hex"), .FILE4("partmod_lut_d6_s16_r16.hex")) inst_d6_3 (
    .clk(clk), .OP_A_mult(Stg3_Dig3_), .OP_B_add(d6_0_2_), .result(d6_0_3_));
  ModMultAdd_8L_v2 #(.MODULUS(262069), .DATA_WIDTH(18), .FILE1("pwrmult_3lut0_d7_0_3.hex"), .FILE2("pwrmult_3lut1_d7_0_3.hex"), .FILE3("pwrmult_3lut2_d7_0_3.hex"), .FILE4("partmod_lut_d7_s16_r16.hex")) inst_d7_3 (
    .clk(clk), .OP_A_mult(Stg3_Dig3_), .OP_B_add(d7_0_2_), .result(d7_0_3_));
  ModMultAdd_8L_v2 #(.MODULUS(262079), .DATA_WIDTH(18), .FILE1("pwrmult_3lut0_d8_0_3.hex"), .FILE2("pwrmult_3lut1_d8_0_3.hex"), .FILE3("pwrmult_3lut2_d8_0_3.hex"), .FILE4("partmod_lut_d8_s16_r16.hex")) inst_d8_3 (
    .clk(clk), .OP_A_mult(Stg3_Dig3_), .OP_B_add(d8_0_2_), .result(d8_0_3_));
  ModMultAdd_8L_v2 #(.MODULUS(262103), .DATA_WIDTH(18), .FILE1("pwrmult_3lut0_d9_0_3.hex"), .FILE2("pwrmult_3lut1_d9_0_3.hex"), .FILE3("pwrmult_3lut2_d9_0_3.hex"), .FILE4("partmod_lut_d9_s16_r16.hex")) inst_d9_3 (
    .clk(clk), .OP_A_mult(Stg3_Dig3_), .OP_B_add(d9_0_2_), .result(d9_0_3_));
  SubInvMult_8L_mlab #(.DATA_WIDTH(18), .MODULUS(262049), .FILE1("invmult_3lut0_5_4.hex"), .FILE2("invmult_3lut1_5_4.hex"), .FILE3("invmult_3lut2_5_4.hex"), .FILE4("partmod_lut_d5_s16_r16.hex")) inst46 (
    .clk(clk), .dataA_in(Stg4_Dig5_), .dataB_in(Stg4_Dig4_), .mod_data_out(Stg5_Dig5_));
  SubInvMult_8L_mlab #(.DATA_WIDTH(18), .MODULUS(262051), .FILE1("invmult_3lut0_6_4.hex"), .FILE2("invmult_3lut1_6_4.hex"), .FILE3("invmult_3lut2_6_4.hex"), .FILE4("partmod_lut_d6_s16_r16.hex")) inst50 (
    .clk(clk), .dataA_in(Stg4_Dig6_), .dataB_in(Stg4_Dig4_), .mod_data_out(Stg5_Dig6_));
  SubInvMult_8L_mlab #(.DATA_WIDTH(18), .MODULUS(262069), .FILE1("invmult_3lut0_7_4.hex"), .FILE2("invmult_3lut1_7_4.hex"), .FILE3("invmult_3lut2_7_4.hex"), .FILE4("partmod_lut_d7_s16_r16.hex")) inst55 (
    .clk(clk), .dataA_in(Stg4_Dig7_), .dataB_in(Stg4_Dig4_), .mod_data_out(Stg5_Dig7_));
  SubInvMult_8L_mlab #(.DATA_WIDTH(18), .MODULUS(262079), .FILE1("invmult_3lut0_8_4.hex"), .FILE2("invmult_3lut1_8_4.hex"), .FILE3("invmult_3lut2_8_4.hex"), .FILE4("partmod_lut_d8_s16_r16.hex")) inst62 (
    .clk(clk), .dataA_in(Stg4_Dig8_), .dataB_in(Stg4_Dig4_), .mod_data_out(Stg5_Dig8_));
  SubInvMult_8L_mlab #(.DATA_WIDTH(18), .MODULUS(262103), .FILE1("invmult_3lut0_9_4.hex"), .FILE2("invmult_3lut1_9_4.hex"), .FILE3("invmult_3lut2_9_4.hex"), .FILE4("partmod_lut_d9_s16_r16.hex")) inst69 (
    .clk(clk), .dataA_in(Stg4_Dig9_), .dataB_in(Stg4_Dig4_), .mod_data_out(Stg5_Dig9_));
  ModMultAdd_8L_v2 #(.MODULUS(262049), .DATA_WIDTH(18), .FILE1("pwrmult_3lut0_d5_0_4.hex"), .FILE2("pwrmult_3lut1_d5_0_4.hex"), .FILE3("pwrmult_3lut2_d5_0_4.hex"), .FILE4("partmod_lut_d5_s16_r16.hex")) inst_d5_4 (
    .clk(clk), .OP_A_mult(Stg4_Dig4_), .OP_B_add(d5_0_3_), .result(d5_0_4_));
  ModMultAdd_8L_v2 #(.MODULUS(262051), .DATA_WIDTH(18), .FILE1("pwrmult_3lut0_d6_0_4.hex"), .FILE2("pwrmult_3lut1_d6_0_4.hex"), .FILE3("pwrmult_3lut2_d6_0_4.hex"), .FILE4("partmod_lut_d6_s16_r16.hex")) inst_d6_4 (
    .clk(clk), .OP_A_mult(Stg4_Dig4_), .OP_B_add(d6_0_3_), .result(d6_0_4_));
  ModMultAdd_8L_v2 #(.MODULUS(262069), .DATA_WIDTH(18), .FILE1("pwrmult_3lut0_d7_0_4.hex"), .FILE2("pwrmult_3lut1_d7_0_4.hex"), .FILE3("pwrmult_3lut2_d7_0_4.hex"), .FILE4("partmod_lut_d7_s16_r16.hex")) inst_d7_4 (
    .clk(clk), .OP_A_mult(Stg4_Dig4_), .OP_B_add(d7_0_3_), .result(d7_0_4_));
  ModMultAdd_8L_v2 #(.MODULUS(262079), .DATA_WIDTH(18), .FILE1("pwrmult_3lut0_d8_0_4.hex"), .FILE2("pwrmult_3lut1_d8_0_4.hex"), .FILE3("pwrmult_3lut2_d8_0_4.hex"), .FILE4("partmod_lut_d8_s16_r16.hex")) inst_d8_4 (
    .clk(clk), .OP_A_mult(Stg4_Dig4_), .OP_B_add(d8_0_3_), .result(d8_0_4_));
  ModMultAdd_8L_v2 #(.MODULUS(262103), .DATA_WIDTH(18), .FILE1("pwrmult_3lut0_d9_0_4.hex"), .FILE2("pwrmult_3lut1_d9_0_4.hex"), .FILE3("pwrmult_3lut2_d9_0_4.hex"), .FILE4("partmod_lut_d9_s16_r16.hex")) inst_d9_4 (
    .clk(clk), .OP_A_mult(Stg4_Dig4_), .OP_B_add(d9_0_3_), .result(d9_0_4_));
  SubInvMult_8L_mlab #(.DATA_WIDTH(18), .MODULUS(262051), .FILE1("invmult_3lut0_6_5.hex"), .FILE2("invmult_3lut1_6_5.hex"), .FILE3("invmult_3lut2_6_5.hex"), .FILE4("partmod_lut_d6_s16_r16.hex")) inst51 (
    .clk(clk), .dataA_in(Stg5_Dig6_), .dataB_in(Stg5_Dig5_), .mod_data_out(Stg6_Dig6_));
  SubInvMult_8L_mlab #(.DATA_WIDTH(18), .MODULUS(262069), .FILE1("invmult_3lut0_7_5.hex"), .FILE2("invmult_3lut1_7_5.hex"), .FILE3("invmult_3lut2_7_5.hex"), .FILE4("partmod_lut_d7_s16_r16.hex")) inst56 (
    .clk(clk), .dataA_in(Stg5_Dig7_), .dataB_in(Stg5_Dig5_), .mod_data_out(Stg6_Dig7_));
  SubInvMult_8L_mlab #(.DATA_WIDTH(18), .MODULUS(262079), .FILE1("invmult_3lut0_8_5.hex"), .FILE2("invmult_3lut1_8_5.hex"), .FILE3("invmult_3lut2_8_5.hex"), .FILE4("partmod_lut_d8_s16_r16.hex")) inst63 (
    .clk(clk), .dataA_in(Stg5_Dig8_), .dataB_in(Stg5_Dig5_), .mod_data_out(Stg6_Dig8_));
  SubInvMult_8L_mlab #(.DATA_WIDTH(18), .MODULUS(262103), .FILE1("invmult_3lut0_9_5.hex"), .FILE2("invmult_3lut1_9_5.hex"), .FILE3("invmult_3lut2_9_5.hex"), .FILE4("partmod_lut_d9_s16_r16.hex")) inst70 (
    .clk(clk), .dataA_in(Stg5_Dig9_), .dataB_in(Stg5_Dig5_), .mod_data_out(Stg6_Dig9_));
  ModMultAdd_8L_v2 #(.MODULUS(262051), .DATA_WIDTH(18), .FILE1("pwrmult_3lut0_d6_0_5.hex"), .FILE2("pwrmult_3lut1_d6_0_5.hex"), .FILE3("pwrmult_3lut2_d6_0_5.hex"), .FILE4("partmod_lut_d6_s16_r16.hex")) inst_d6_5 (
    .clk(clk), .OP_A_mult(Stg5_Dig5_), .OP_B_add(d6_0_4_), .result(d6_0_5_));
  ModMultAdd_8L_v2 #(.MODULUS(262069), .DATA_WIDTH(18), .FILE1("pwrmult_3lut0_d7_0_5.hex"), .FILE2("pwrmult_3lut1_d7_0_5.hex"), .FILE3("pwrmult_3lut2_d7_0_5.hex"), .FILE4("partmod_lut_d7_s16_r16.hex")) inst_d7_5 (
    .clk(clk), .OP_A_mult(Stg5_Dig5_), .OP_B_add(d7_0_4_), .result(d7_0_5_));
  ModMultAdd_8L_v2 #(.MODULUS(262079), .DATA_WIDTH(18), .FILE1("pwrmult_3lut0_d8_0_5.hex"), .FILE2("pwrmult_3lut1_d8_0_5.hex"), .FILE3("pwrmult_3lut2_d8_0_5.hex"), .FILE4("partmod_lut_d8_s16_r16.hex")) inst_d8_5 (
    .clk(clk), .OP_A_mult(Stg5_Dig5_), .OP_B_add(d8_0_4_), .result(d8_0_5_));
  ModMultAdd_8L_v2 #(.MODULUS(262103), .DATA_WIDTH(18), .FILE1("pwrmult_3lut0_d9_0_5.hex"), .FILE2("pwrmult_3lut1_d9_0_5.hex"), .FILE3("pwrmult_3lut2_d9_0_5.hex"), .FILE4("partmod_lut_d9_s16_r16.hex")) inst_d9_5 (
    .clk(clk), .OP_A_mult(Stg5_Dig5_), .OP_B_add(d9_0_4_), .result(d9_0_5_));
  SubInvMult_8L_mlab #(.DATA_WIDTH(18), .MODULUS(262069), .FILE1("invmult_3lut0_7_6.hex"), .FILE2("invmult_3lut1_7_6.hex"), .FILE3("invmult_3lut2_7_6.hex"), .FILE4("partmod_lut_d7_s16_r16.hex")) inst57 (
    .clk(clk), .dataA_in(Stg6_Dig7_), .dataB_in(Stg6_Dig6_), .mod_data_out(Stg7_Dig7_));
  SubInvMult_8L_mlab #(.DATA_WIDTH(18), .MODULUS(262079), .FILE1("invmult_3lut0_8_6.hex"), .FILE2("invmult_3lut1_8_6.hex"), .FILE3("invmult_3lut2_8_6.hex"), .FILE4("partmod_lut_d8_s16_r16.hex")) inst64 (
    .clk(clk), .dataA_in(Stg6_Dig8_), .dataB_in(Stg6_Dig6_), .mod_data_out(Stg7_Dig8_));
  SubInvMult_8L_mlab #(.DATA_WIDTH(18), .MODULUS(262103), .FILE1("invmult_3lut0_9_6.hex"), .FILE2("invmult_3lut1_9_6.hex"), .FILE3("invmult_3lut2_9_6.hex"), .FILE4("partmod_lut_d9_s16_r16.hex")) inst71 (
    .clk(clk), .dataA_in(Stg6_Dig9_), .dataB_in(Stg6_Dig6_), .mod_data_out(Stg7_Dig9_));
  ModMultAdd_8L_v2 #(.MODULUS(262069), .DATA_WIDTH(18), .FILE1("pwrmult_3lut0_d7_0_6.hex"), .FILE2("pwrmult_3lut1_d7_0_6.hex"), .FILE3("pwrmult_3lut2_d7_0_6.hex"), .FILE4("partmod_lut_d7_s16_r16.hex")) inst_d7_6 (
    .clk(clk), .OP_A_mult(Stg6_Dig6_), .OP_B_add(d7_0_5_), .result(d7_0_6_));
  ModMultAdd_8L_v2 #(.MODULUS(262079), .DATA_WIDTH(18), .FILE1("pwrmult_3lut0_d8_0_6.hex"), .FILE2("pwrmult_3lut1_d8_0_6.hex"), .FILE3("pwrmult_3lut2_d8_0_6.hex"), .FILE4("partmod_lut_d8_s16_r16.hex")) inst_d8_6 (
    .clk(clk), .OP_A_mult(Stg6_Dig6_), .OP_B_add(d8_0_5_), .result(d8_0_6_));
  ModMultAdd_8L_v2 #(.MODULUS(262103), .DATA_WIDTH(18), .FILE1("pwrmult_3lut0_d9_0_6.hex"), .FILE2("pwrmult_3lut1_d9_0_6.hex"), .FILE3("pwrmult_3lut2_d9_0_6.hex"), .FILE4("partmod_lut_d9_s16_r16.hex")) inst_d9_6 (
    .clk(clk), .OP_A_mult(Stg6_Dig6_), .OP_B_add(d9_0_5_), .result(d9_0_6_));
  SubInvMult_8L_mlab #(.DATA_WIDTH(18), .MODULUS(262079), .FILE1("invmult_3lut0_8_7.hex"), .FILE2("invmult_3lut1_8_7.hex"), .FILE3("invmult_3lut2_8_7.hex"), .FILE4("partmod_lut_d8_s16_r16.hex")) inst72 (
    .clk(clk), .dataA_in(Stg7_Dig8_), .dataB_in(Stg7_Dig7_), .mod_data_out(Stg8_Dig8_));
  SubInvMult_8L_mlab #(.DATA_WIDTH(18), .MODULUS(262103), .FILE1("invmult_3lut0_9_7.hex"), .FILE2("invmult_3lut1_9_7.hex"), .FILE3("invmult_3lut2_9_7.hex"), .FILE4("partmod_lut_d9_s16_r16.hex")) inst73 (
    .clk(clk), .dataA_in(Stg7_Dig9_), .dataB_in(Stg7_Dig7_), .mod_data_out(Stg8_Dig9_));
  ModMultAdd_8L_v2 #(.MODULUS(262079), .DATA_WIDTH(18), .FILE1("pwrmult_3lut0_d8_0_7.hex"), .FILE2("pwrmult_3lut1_d8_0_7.hex"), .FILE3("pwrmult_3lut2_d8_0_7.hex"), .FILE4("partmod_lut_d8_s16_r16.hex")) inst_d8_7 (
    .clk(clk), .OP_A_mult(Stg7_Dig7_), .OP_B_add(d8_0_6_), .result(d8_0_7_));
  ModMultAdd_8L_v2 #(.MODULUS(262103), .DATA_WIDTH(18), .FILE1("pwrmult_3lut0_d9_0_7.hex"), .FILE2("pwrmult_3lut1_d9_0_7.hex"), .FILE3("pwrmult_3lut2_d9_0_7.hex"), .FILE4("partmod_lut_d9_s16_r16.hex")) inst_d9_7 (
    .clk(clk), .OP_A_mult(Stg7_Dig7_), .OP_B_add(d9_0_6_), .result(d9_0_7_));
  SubInvMult_8L_mlab #(.DATA_WIDTH(18), .MODULUS(262103), .FILE1("invmult_3lut0_9_8.hex"), .FILE2("invmult_3lut1_9_8.hex"), .FILE3("invmult_3lut2_9_8.hex"), .FILE4("partmod_lut_d9_s16_r16.hex")) inst74 (
    .clk(clk), .dataA_in(Stg8_Dig9_), .dataB_in(Stg8_Dig8_), .mod_data_out(Stg9_Dig9_));
  ModMultAdd_8L_v2 #(.MODULUS(262103), .DATA_WIDTH(18), .FILE1("pwrmult_3lut0_d9_0_8.hex"), .FILE2("pwrmult_3lut1_d9_0_8.hex"), .FILE3("pwrmult_3lut2_d9_0_8.hex"), .FILE4("partmod_lut_d9_s16_r16.hex")) inst_d9_8 (
    .clk(clk), .OP_A_mult(Stg8_Dig8_), .OP_B_add(d9_0_7_), .result(d9_0_8_));
  fixed_val #(.DATA_WIDTH(2), .MCONSTANT(1)) inst_const1 (.value(inst_const1_value));
  ModCompare_9L_mlab #(.DATA_WIDTH(18), .MCONSTANT(32768)) inst1 (
    .clk(clk), .in_A_0_(Dig_in_0_), .sign_in(inst_const1_value), .sign_result(Sgn_out_0_));  // open: cout_stage3
  ModCompare_9L_mlab #(.DATA_WIDTH(18), .MCONSTANT(39062)) inst10 (
    .clk(clk), .in_A_0_(Stg1_Dig1_), .sign_in(Sgn_out_0_), .sign_result(Sgn_out_1_));  // open: cout_stage3
  ModCompare_9L_mlab #(.DATA_WIDTH(18), .MCONSTANT(58824)) inst11 (
    .clk(clk), .in_A_0_(Stg2_Dig2_), .sign_in(Sgn_out_1_), .sign_result(Sgn_out_2_));  // open: cout_stage3
  ModCompare_9L_mlab #(.DATA_WIDTH(18), .MCONSTANT(88573)) inst12 (
    .clk(clk), .in_A_0_(Stg3_Dig3_), .sign_in(Sgn_out_2_), .sign_result(Sgn_out_3_));  // open: cout_stage3
  ModCompare_9L_mlab #(.DATA_WIDTH(18), .MCONSTANT(131013)) inst13 (
    .clk(clk), .in_A_0_(Stg4_Dig4_), .sign_in(Sgn_out_3_), .sign_result(Sgn_out_4_));  // open: cout_stage3
  ModCompare_9L_mlab #(.DATA_WIDTH(18), .MCONSTANT(131024)) inst14 (
    .clk(clk), .in_A_0_(Stg5_Dig5_), .sign_in(Sgn_out_4_), .sign_result(Sgn_out_5_));  // open: cout_stage3
  ModCompare_9L_mlab #(.DATA_WIDTH(18), .MCONSTANT(131025)) inst15 (
    .clk(clk), .in_A_0_(Stg6_Dig6_), .sign_in(Sgn_out_5_), .sign_result(Sgn_out_6_));  // open: cout_stage3
  ModCompare_9L_mlab #(.DATA_WIDTH(18), .MCONSTANT(131034)) inst16 (
    .clk(clk), .in_A_0_(Stg7_Dig7_), .sign_in(Sgn_out_6_), .sign_result(Sgn_out_7_));  // open: cout_stage3
  ModDualCmp_9L_2in #(.DATA_WIDTH(18), .NEG_DIGIT(262078), .POS_DIGIT(0)) inst19 (
    .clk(clk), .in_A_0_(Stg8_Dig8_), .sign_in_A(Sgn_out_7_), .sign_in_B(Sgn_out_7_),
    .sign_result_A(Sgn_out_8_A), .sign_result_B(Sgn_out_8_B));  // open: pos_cout_stage3, neg_cout_stage3
  ModDualCmp_9L_2in #(.DATA_WIDTH(18), .NEG_DIGIT(262102), .POS_DIGIT(0)) inst21 (
    .clk(clk), .in_A_0_(Stg9_Dig9_), .sign_in_A(Sgn_out_8_A), .sign_in_B(Sgn_out_8_B),
    .sign_result_A(Sgn_out_9_A), .sign_result_B(Sgn_out_9_B));  // open: pos_cout_stage3, neg_cout_stage3

  assign Stg0_Dig1_ = Dig_in_1_;
  assign Stg0_Dig2_ = Dig_in_2_;
  assign Stg0_Dig3_ = Dig_in_3_;
  assign Stg0_Dig4_ = Dig_in_4_;
  assign Stg0_Dig5_ = Dig_in_5_;
  assign Stg0_Dig6_ = Dig_in_6_;
  assign Stg0_Dig7_ = Dig_in_7_;
  assign Stg0_Dig8_ = Dig_in_8_;
  assign Stg0_Dig9_ = Dig_in_9_;

  // Other names for the same wires on the sheet: Stg0_Dig0_[17:0] = Dig_in_0_

  // Notes on the sheet:
  //   positive MR const:                                     131024, 131025, 131024, 131013, 88573, 58824, 39062, 32768
  //   negative MR const:  262102, 262078, 131024, 131025, 131024, 131013, 88573, 58824, 39062, 32768
  //   COMPARISON CONSTANTS IDENTICAL BETWEEN POSITIVE AND NEGATIVE RANGES EXCEPT FOR LAST TWO DIGITS
  //   EQUAL =: 01
  //   RE-COMBINATION UNIT IS ALSO A TRIANGULAR TREE STRUCTURE, SINCE EACH DIGIT RECOMBINATION MUST BE STARTED
  //   Skip Digit 0
  //   8 stage reduction
  //   Skip Digit 1
  //   7 stage reduction
  //   (one stage done)
  //   Skip Digit 2
  //   6 stage reduction
  //   (two stage done)
  //   Skip Digit 3
  //   5 stage reduction
  //   (three stage done)
  //   Skip Digit 4
  //   4 stage reduction
  //   (four stage done)
  //   Skip Digit 5
  //   3 stage reduction
  //   (five stage done)
  //   Skip Digit 6
  //   2 stage reduction
  //   (six stage done)
  //   Skip Digit 7
  //   1 stage reduction
  //   (seven stage done)
  //   Skip Digit 8
  //   0 stage reduction
  //   (eight stage done)
  //   Skip Digit 9
  //   0 stage reduction
  //   (eight stage done)
endmodule
